# EasyEDA Pro project CH32V203_Wireless_Charge_V2.0.eprj

# Schematic CH32V203_Wireless_Charge
Create Date: 2023-07-03; Page Name: P1; Project Name: CH32V203_Wireless_Charge_V2.0; Schematic Name: CH32V203_Wireless_Charge; Update Date: 2023-07-03; Company: 嘉立创EDA; Page Size: A4; Version: V1.0
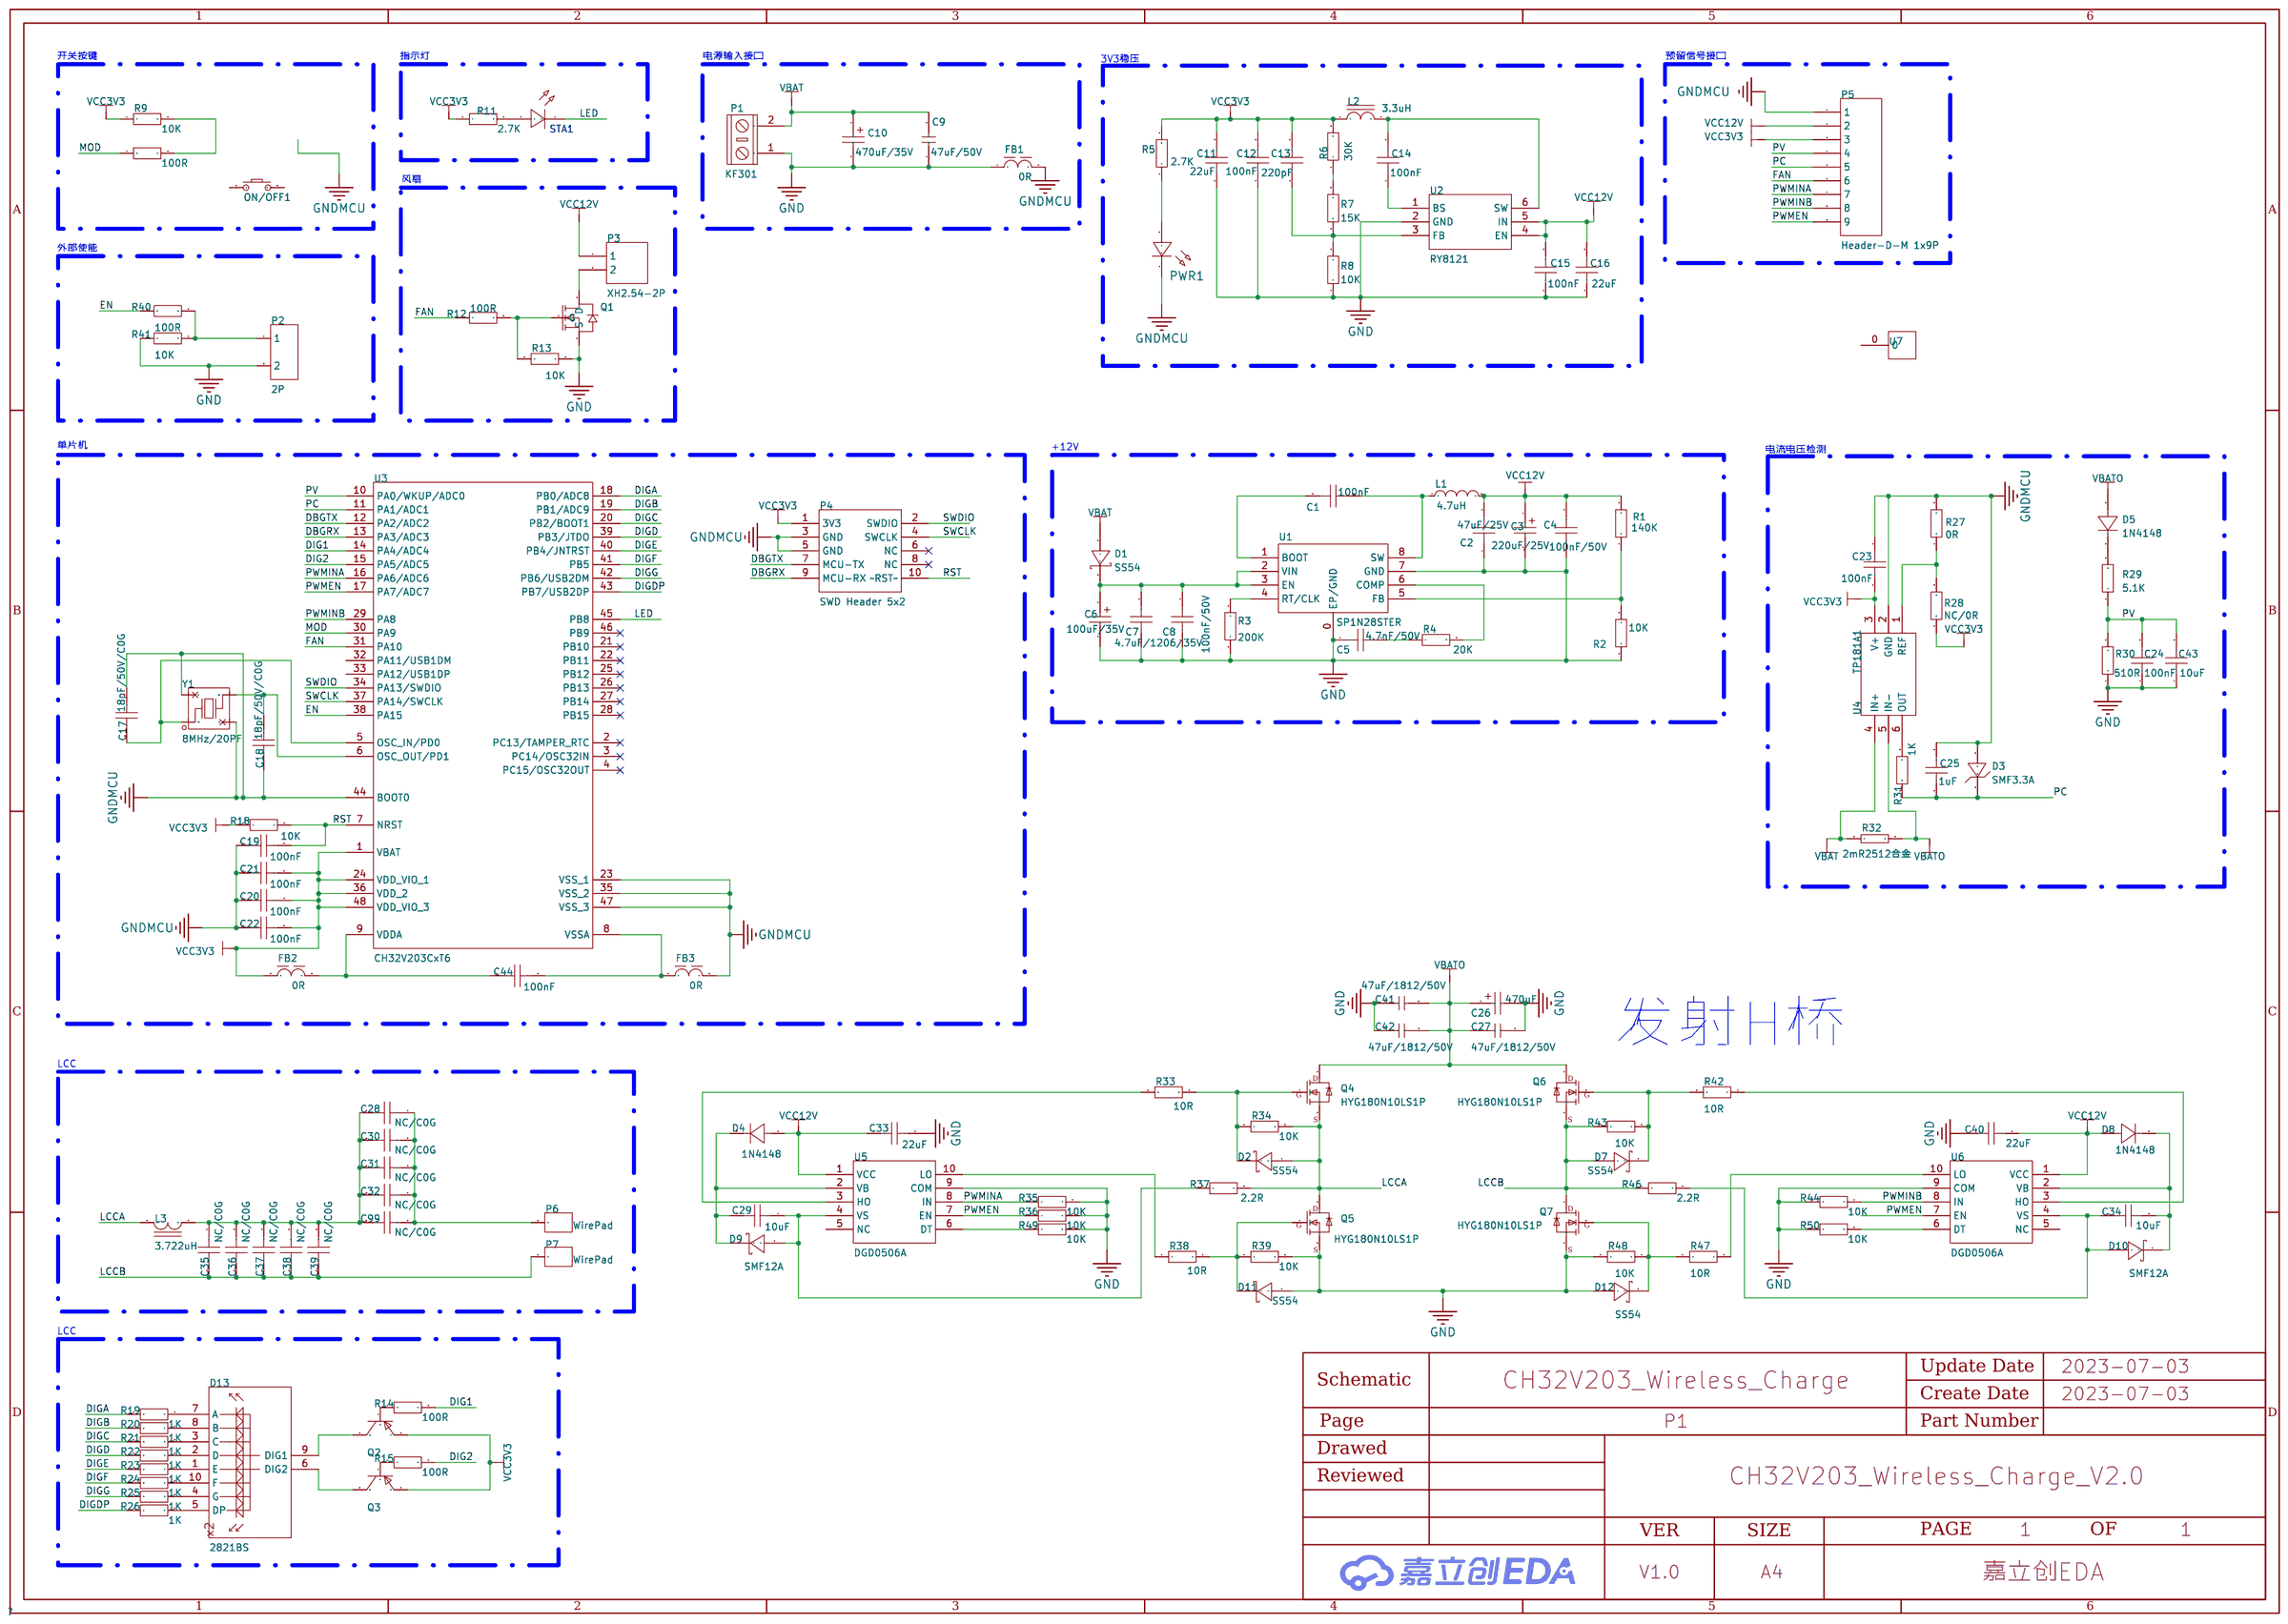
[diagram p0: schematic sheet]

## Parts
C1  100nF  [C0603]
C2  47uF/25V  [C1206]
C3  220uF  [Cap-S-D 2.5-6.3X8]
C4  100nF/50V  [C0603]
C5  4.7nF/50V  [C0603]
C6  100uF  [Cap-S-D 2.5-6.3X8]
C7  4.7uF/1206/35V  [C1206]
C8  100nF/50V  [C0603]
C9  47uF  [CAPC4532[1812]S]
C10  470uF  [Cap-S-D 3.5-8x14]
C11  22uF  [C0805]
C12  100nF  [C0603]
C13  220pF  [C0603]
C14  100nF  [C0603]
C15  100nF  [C0603]
C16  22uF  [C0805]
C17  18pF/50V/C0G  [C0603]
C18  18pF/50V/C0G  [C0603]
C19  100nF  [C0603]
C20  100nF  [C0603]
C21  100nF  [C0603]
C22  100nF  [C0603]
C23  100nF  [C0603]
C24  100nF  [C0603]
C25  1uF  [C0603]
C26  470uF  [Cap-S-D 3.5-8x14]
C27  47uF  [CAPC4532[1812]S]
C28  NC/C0G  [C1206]
C29  10uF  [C0805]
C30  NC/C0G  [C1206]
C31  NC/C0G  [C1206]
C32  NC/C0G  [C1206]
C33  22uF  [C0805]
C34  10uF  [C0805]
C35  NC/C0G  [C1206]
C36  NC/C0G  [C1206]
C37  NC/C0G  [C1206]
C38  NC/C0G  [C1206]
C39  NC/C0G  [C1206]
C40  22uF  [C0805]
C41  47uF  [CAPC4532[1812]S]
C42  47uF  [CAPC4532[1812]S]
C43  10uF  [C0805]
C44  100nF  [C0603]
C99  NC/C0G  [C1206]
D1  SS54  [SMA_L4.4-W2.8-LS5.4-R-RD]
D2  SS54  [SMA_L4.4-W2.8-LS5.4-R-RD]
D3  SMF3.3A  [SOD-123_L2.8-W1.8-LS3.7-RD]
D4  1N4148  [SOD-123_L2.7-W1.6-LS3.7-RD]
D5  1N4148  [SOD-123_L2.7-W1.6-LS3.7-RD]
D7  SS54  [SMA_L4.4-W2.8-LS5.4-R-RD]
D8  1N4148  [SOD-123_L2.7-W1.6-LS3.7-RD]
D9  SMF12A  [SOD-123F_L2.8-W1.8-LS3.7-RD]
D10  SMF12A  [SOD-123F_L2.8-W1.8-LS3.7-RD]
D11  SS54  [SMA_L4.4-W2.8-LS5.4-R-RD]
D12  SS54  [SMA_L4.4-W2.8-LS5.4-R-RD]
D13  2821BS  [2821AS/BS]
FB1  0R  [INDC1608[0603]S]
FB2  0R  [INDC1608[0603]S]
FB3  0R  [INDC1608[0603]S]
L1  4.7uH  [IND-SMD_L7.3-W6.6]
L2  3.3uH  [0402 TPC 4*4*2]
L3  3.722uH  [T94/106-LAY]
ON/OFF1  Button  [KEY-2-DIP-6*6-S]
P1  KF301  [KF/WJ/DG 301-2p-5.0mm]
P2  2P  [HDR-TH_2P-P2.54-V-M-1]
P3  XH2.54-2P  [XH2.54-2P-DV]
P4  SWD  [HDR2X5-M]
P5  Header-D-M1x9P  [HDR1X9-M]
P6  WirePad  [WirePad-4x6]
P7  WirePad  [WirePad-4x6]
PWR1  -  [LED_0603]
Q1  -  [SOT-23-3_L2.9-W1.3-P1.90-LS2.4-BR]
Q2  -  [S8550P_SOT]
Q3  -  [S8550P_SOT]
Q4  HYG180N10LS1P  [TO-220-LAY]
Q5  HYG180N10LS1P  [TO-220-LAY]
Q6  HYG180N10LS1P  [TO-220-LAY]
Q7  HYG180N10LS1P  [TO-220-LAY]
R1  140K  [R0603]
R2  10K  [R0603]
R3  200K  [R0603]
R4  20K  [R0603]
R5  2.7K  [R0603]
R6  30K  [R0603]
R7  15K  [R0603]
R8  10K  [R0603]
R9  10K  [R0603]
R10  100R  [R0603]
R11  2.7K  [R0603]
R12  100R  [R0603]
R13  10K  [R0603]
R14  100R  [R0603]
R15  100R  [R0603]
R18  10K  [R0603]
R19  1K  [R0603]
R20  1K  [R0603]
R21  1K  [R0603]
R22  1K  [R0603]
R23  1K  [R0603]
R24  1K  [R0603]
R25  1K  [R0603]
R26  1K  [R0603]
R27  0R  [R0603]
R28  NC/0R  [R0603]
R29  5.1K  [R0603]
R30  510R  [R0603]
R31  1K  [R0603]
R32  2mR  [RESC6332[2512]S]
R33  10R  [R0603]
R34  10K  [R0603]
R35  10K  [R0603]
R36  10K  [R0603]
R37  2.2R  [R0603]
R38  10R  [R0603]
R39  10K  [R0603]
R40  100R  [R0603]
R41  10K  [R0603]
R42  10R  [R0603]
R43  10K  [R0603]
R44  10K  [R0603]
R46  2.2R  [R0603]
R47  10R  [R0603]
R48  10K  [R0603]
R49  10K  [R0603]
R50  10K  [R0603]
STA1  -  [LED_0603]
U1  SP1N28STER  [SP1N28STER]
U2  RY8121  [SOT-23-6]
U3  CH32V203CxT6  [LQFP48_L]
U4  TP181A1  [SOT-363]
U5  DGD0506A  [MSOP-10]
U6  DGD0506A  [MSOP-10]
U7  -  [Cooler-5.5]
Y1  8MHz/20PF  [X3225-4]

## Library data of the parts
C1 C4 C5 C8 C12-C15 C17-C25 C44 = CAP_0603: Supplier Footprint: 0603
C2 C7 C28 C30-C32 C35-C39 C99 = CAP_1206: Supplier Footprint: 1206
C3 = S-D 220uF 25V 6.3x8: Revision: V1.0; Type: 聚合物固态; Voltage: 25V
C6 = S-D 100uF 35V 6.3x8: Revision: V1.0; Type: 聚合物固态; Voltage: 35V
C9 C27 C41 C42 = 47uF 1812 50V X5R: Revision: V1.0; Voltage: 50V; Type: X5R; Origin Footprint 2: CAPC4532[1812]
C10 C26 = S-D 470uF 35V 8x14: Revision: V1.0; Type: 聚合物固态; Voltage: 35V
C11 C16 C29 C33 C34 C40 C43 = CAP_0805: Supplier Footprint: 0805
D1 D2 D7 D11 D12 = SS54_C22452: 直流反向耐压(Vr):40V;平均整流电流(Io):5A;正向压降(Vf):550mV@5A;; LCSC Part Name: 40V5A550mV@5A; Supplier Part: C22452; Manufacturer: MDD; Supplier Footprint: SMA(DO-214AC); JLCPCB Part Class: 基础库; Datasheet: https://atta.szlcsc.com/upload/public/pdf/source/20190306/C22452_DC5E4F74C3B638F6D8E4C7650D5BF30E.pdf; Supplier: LCSC; Reverse Voltage (Vr): 40V; Average Rectified Current (Io): 5A; Forward Voltage (Vf@If): 550mV@5A
D3 = SMF3.3A_C283866: 极性:单向;反向截止电压(Vrwm):3.3V;击穿电压:5.2V;反向漏电流(Ir):600uA;峰值脉冲电流(Ipp)@10/1000μs:25A;最大钳位电压:8V;; LCSC Part Name: 单向Vrwm:3.3V; Supplier Part: C283866; Manufacturer: DOWO(东沃); Supplier Footprint: SOD-123; JLCPCB Part Class: ExtendedPart; Datasheet: https://atta.szlcsc.com/upload/public/pdf/source/20180913/C283866_6B3FC7DB82D40F63EC323F6A8CE1774A.pdf; Supplier: LCSC; Polarity: 单向; Reverse Stand-Off Voltage (Vrwm): 3.3V; Breakdown Voltage: 5.2V; Reverse Leakage Current (Ir): 600uA; Peak Pulse Current (Ipp)@10/1000μs: 25A; Maximum Clamping Voltage: 8V
D4 D5 D8 = 1N4148W_C908248: 二极管配置:独立式;功率:400mW;直流反向耐压(Vr):75V;平均整流电流(Io):150mA;正向压降(Vf):1.25V@150mA;反向电流(Ir):2.5μA@75V;反向恢复时间(trr):8ns;工作温度:-55℃~+150℃@(Tj);; LCSC Part Name: 75V150mA8ns; Supplier Part: C908248; Manufacturer: FUXINSEMI(富芯森美); Supplier Footprint: SOD-123; JLCPCB Part Class: ExtendedPart; Datasheet: https://atta.szlcsc.com/upload/public/pdf/source/20201027/C908248_1CA42330540990D53F511325C125C4BD.pdf; Supplier: LCSC; Diode Configuration: 独立式; Power Dissipation: 400mW; Reverse Voltage (Vr): 75V; Average Rectified Current (Io): 150mA; Forward Voltage (Vf@If): 1.25V@150mA; Reverse Leakage Current: 2.5μA@75V; Reverse Recovery Time (trr): 8ns; Operating Temperature: -55℃~+150℃@(Tj)
D9 D10 = SMF12A_C207255: 极性:单向;反向截止电压(Vrwm):12V;击穿电压:13.3V;峰值脉冲电流(Ipp)@10/1000μs:-;最大钳位电压:19.9V;峰值脉冲功率(Ppp)@10/1000μs:200W;; LCSC Part Name: 单向Vrwm:12V200W; Supplier Part: C207255; Manufacturer: Littelfuse(美国力特); Supplier Footprint: SOD-123F; JLCPCB Part Class: ExtendedPart; Datasheet: https://atta.szlcsc.com/upload/public/pdf/source/20180517/C207255_4FB9557FD9A9DAB230014B48638D9A3D.pdf; Supplier: LCSC; Polarity: 单向; Reverse Stand-Off Voltage (Vrwm): 12V; Breakdown Voltage: 13.3V; Maximum Clamping Voltage: 19.9V; Peak Pulse Power Dissipation (Ppp)@10/1000μs: 200W
D13 = 2821BS
FB1-FB3 = FB-Chip: Published: 2020-12-18; Revision: V1.0; DCR: .1m; Frequency: @100MHz; Imax: 500mA; Origin Footprint 2: INDC2012[0805]S; Origin Footprint 3: INDC3216[1206]S; Origin Footprint 4: INDC4509[1806]S; Origin Footprint 5: INDC1005[0402]; Origin Footprint 6: INDC1608[0603]; Origin Footprint 7: INDC2012[0805]; Origin Footprint 8: INDC3216[1206]; Origin Footprint 9: INDC3225[1210]; Origin Footprint 10: INDC3216[1206]; Origin Footprint 11: INDC1005[0402]S
L1 = MCS0630-4R7MPY1: 电感值:4.7uH;精度:±20%;额定电流:5.5A;饱和电流(Isat):7A;直流电阻(DCR):37mΩ;; LCSC Part Name: 4.7uH±20%5.5A37mΩ; Supplier Part: C2937097; Manufacturer: PSA(信昌电陶); Supplier Footprint: 0630; JLCPCB Part Class: 扩展库; Datasheet: https://atta.szlcsc.com/upload/public/pdf/source/20220121/EA6E6E6F70ED7BAE67EC293805EAAACB.pdf; Supplier: LCSC; Tolerance: ±20%; Rated Current: 5.5A; Saturation Current (Isat): 7A; DC Resistance (DCR): 37mΩ
L2 = Ind-Power_1: Published: 8-Jun-2000; Revision: July-2002:Re-releasedforDXPPlatform.; Publisher: AltiumLimited; DCR: .5m; Price(RMB): 0.000; Imax: 2.5A; Origin Footprint 2: CD31; Origin Footprint 3: CD32; Origin Footprint 4: CD42; Origin Footprint 5: CD43; Origin Footprint 6: CD52; Origin Footprint 7: CD53; Origin Footprint 8: CD54; Origin Footprint 9: CD73; Origin Footprint 10: CD75; Origin Footprint 11: CD104; Origin Footprint 12: CD105; Origin Footprint 13: CD106; Origin Footprint 14: 127Shielded12.5*12.5*7; Origin Footprint 15: 0630TPC7*7*3; Origin Footprint 16: 1050TPC10*10*5; Origin Footprint 17: 1265TPC12*12*6.5; Origin Footprint 18: CD104R; Origin Footprint 19: SLO2520; Origin Footprint 20: 1365TPC13*13*6.5; Origin Footprint 21: INDUCTOR; Origin Footprint 22: INDUCTOR-H
L3 = Ind-Power_2: Published: 8-Jun-2000; Revision: July-2002:Re-releasedforDXPPlatform.; Publisher: AltiumLimited; Imax: 50mA; DCR: .5m; Price(RMB): 0.000; Origin Footprint 2: CD31; Origin Footprint 3: CD32; Origin Footprint 4: CD42; Origin Footprint 5: CD43; Origin Footprint 6: CD52; Origin Footprint 7: CD53; Origin Footprint 8: CD54; Origin Footprint 9: CD73; Origin Footprint 10: CD75; Origin Footprint 11: CD104; Origin Footprint 12: CD105; Origin Footprint 13: CD106; Origin Footprint 14: 127Shielded12.5*12.5*7; Origin Footprint 15: 0630TPC7*7*3; Origin Footprint 16: 1050TPC10*10*5; Origin Footprint 17: 1265TPC12*12*6.5; Origin Footprint 18: CD104R; Origin Footprint 19: SLO2520; Origin Footprint 20: 1365TPC13*13*6.5; Origin Footprint 21: T80125
ON/OFF1 = KEY: Published: 24-Mar-1999; Publisher: Altium Limited; Price(RMB): 0.000; Origin Footprint 2: KEY-2-SMD-3*4; Origin Footprint 3: KEY-4-DIP-6*6; Origin Footprint 4: PTS810-3*4-CurvePin; Origin Footprint 5: KEY-2-SMD-3*6-L; Origin Footprint 6: KEY-2-SMD-3*6-M; Origin Footprint 7: KEY-4-SMD-6*6; Origin Footprint 8: KEY-2-SMD-Side-3*6*3.5; Origin Footprint 9: KEY-4-SMD-12*12; Origin Footprint 10: TS-1809SM-A; Origin Footprint 11: TS-1199A
P1 = KF/WJ/DG 30x
P2 = 826629-2: 排数:单排;总PIN位数:2;间距:2.54mm;插针结构:1x2P;行距:-;安装类型:直插;圆针/方针:-;额定电流:-;额定电压:-;配合针长度:-;塑高:2.8mm;触头材质:黄铜;触头镀层:-;颜色:绿色;; LCSC Part Name: 2.54mm1x2P直插; Supplier Part: C86471; Manufacturer: TEConnectivity(美国泰科); Supplier Footprint: 插件,P=2.54mm; JLCPCB Part Class: ExtendedPart; Datasheet: https://atta.szlcsc.com/upload/public/pdf/source/20161105/1478330325829.pdf; Supplier: LCSC; Number of Rows: 单排; Number of Pins: 2; Pitch: 2.54mm; Pin Structure: 1x2P; Mounting Type: 直插; Insulation Height: 2.8mm; Contact Material: 黄铜; Color: 绿色
P3 = XH2.54-2P: Revision: V1.0; Origin Footprint 2: XH2.54-2P-DH; Origin Footprint 3: XH2.54-2P-SH
P4 = SWD Header 5x2: Revision: V1.0; Origin Footprint 2: HDR2X5-M-SMT
P5 = Header-D-M 1x9P: Revision: V1.0
P6 P7 = WirePad: Origin Footprint 2: WirePad-4.5x7
PWR1 = LED_0603-R: Supplier Footprint: 0603
Q1 = AO3400A_N: 类型:N沟道;漏源电压(Vdss):30V;连续漏极电流(Id):5.2A;功率(Pd):1W;导通电阻(RDS(on)@Vgs,Id):35mΩ@10V,5A;阈值电压(Vgs(th)@Id):1.5V@250μA;; Supplier Footprint: SOT-23; Supplier Part: C700953
Q2 Q3 = S8550_SOT_PNP: Supplier Footprint: SOT-23
Q4-Q7 = HYG180N10LS1P: Origin Footprint 2: TO-220
R1-R15 R18-R31 R33-R44 R46-R50 = Res_0603: Supplier Footprint: 0603
R32 = Res-Chip_10: Revision: V1.0; Power: 1/8W; Tolerance: ±1%; Origin Footprint 2: RESC0603[0201]-L; Origin Footprint 3: RESC0603[0201]-M; Origin Footprint 4: RESC0603[0201]-N; Origin Footprint 5: RESC0603[0201]S-L; Origin Footprint 6: RESC0603[0201]S-M; Origin Footprint 7: RESC0603[0201]S-N; Origin Footprint 8: RESC1005[0402]-L; Origin Footprint 9: RESC1005[0402]S-M; Origin Footprint 10: RESC1005[0402]-M; Origin Footprint 11: RESC1005[0402]-N; Origin Footprint 12: RESC1005[0402]S-L; Origin Footprint 13: RESC1005[0402]S-N; Origin Footprint 14: RESC1608[0603]-L; Origin Footprint 15: RESC1608[0603]-M; Origin Footprint 16: RESC1608[0603]-N; Origin Footprint 17: RESC1608[0603]S-L; Origin Footprint 18: RESC1608[0603]S-M; Origin Footprint 19: RESC1608[0603]S-N; Origin Footprint 20: RESC2012[0805]; Origin Footprint 21: RESC2012[0805]S-L; Origin Footprint 22: RESC2012[0805]S-M; Origin Footprint 23: RESC2012[0805]S-N; Origin Footprint 24: RESC3216[1206]; Origin Footprint 25: RESC3216[1206]S-L; Origin Footprint 26: RESC3216[1206]S-M; Origin Footprint 27: RESC3216[1206]S-N; Origin Footprint 28: RESC3225[1210]; Origin Footprint 29: RESC3225[1210]S; Origin Footprint 30: RESC5025[2010]; Origin Footprint 31: RESC5025[2010]S; Origin Footprint 32: RESC6332[2512]
STA1 = LED_0603-B: Supplier Footprint: 0603
U1 = SP1N28STER: Revision: V1.0
U2 = RY8121
U3 = CH32V203CxT6: Published: 30-May-2008; DatasheetVersion: rev6,Mar-2008; PackageVersion: Mar-2008; PackageReference: LQFP48; Publisher: AltiumLimited; PackageDescription: 48-PinLow-ProfileQuadFlatPack,7x7mmBody,0.5mmPitch(LQFP48); ComponentLink1Description: ManufacturerLink; ComponentLink1URL: www.st.com/stm32; ComponentLink2Description: Datasheet; ComponentLink2URL: http://www.st.com/stonline/products/literature/ds/13587.pdf; Origin Footprint 2: LQFP48_N; Origin Footprint 3: LQFP48_M
U4 = TP181Ax
U5 U6 = DGD0506A
U7 = fan
Y1 = XTAL-4: Published: 8-Jun-2000; Revision: July-2002:Re-releasedforDXPPlatform.; Publisher: AltiumLimited; Load Capactiance: 20pF; Frequency: 8MHz; Origin Footprint 2: X2016-4

## Nets
GND: C2.1 C3.2 C4.1 C5.1 C6.2 C7.1 C8.1 C9.1 C10.2 C11.1 C12.1 C15.1 C16.1 C24.1 C26.2 C27.2 C33.1 C40.1 C41.1 C42.1 C43.1 D11.1(A) D12.1(A) FB1.1 P1.1 P2.2 Q1.2(S) Q5.3(S) Q7.3(S) R2.1 R3.1 R8.1 R13.2 R30.1 R35.2 R36.2 R39.2 R41.1 R44.2 R48.2 R49.2 R50.2 U1.0(EP/GND) U1.7(GND) U2.2(GND) U5.9(COM) U6.9(COM)
GNDMCU: C17.2 C18.1 C19.1 C20.1 C21.1 C22.1 C23.2 C25.2 D3.2 FB1.2 FB3.2 P4.3(GND) P4.5(GND) P5.1 PWR1.1(C) R27.2 U3.23(VSS_1) U3.35(VSS_2) U3.44(BOOT0) U3.47(VSS_3) U4.2(GND) Y1.2(NC) Y1.4(NC)
VBAT: C9.2 C10.1 D1.1(A) P1.2 R32.1 U4.4(IN+)
VBATO: C26.1 C27.1 C41.2 C42.2 D5.2(A) Q4.2(D) Q6.2(D) R32.2 U4.5(IN-)
VCC3V3: C11.2 C12.2 C13.2 C20.2 C21.2 C22.2 C23.1 FB2.1 L2.1 P4.1(3V3) P5.3 Q2.2(E) Q3.2(E) R5.2 R6.2 R9.1 R11.1 R18.1 R28.1 U3.1(VBAT) U3.24(VDD_VIO_1) U3.36(VDD_2) U3.48(VDD_VIO_3) U4.3(V+)
VCC12V: C2.2 C3.1 C4.2 C15.2 C16.2 C33.2 C40.2 D4.2(A) D8.2(A) L1.2 P3.1 P5.2 R1.2 U2.4(EN) U2.5(IN) U5.1(VCC) U6.1(VCC)
DBGRX: P4.9(MCU-RX) U3.13(PA3/ADC3)
DBGTX: P4.7(MCU-TX) U3.12(PA2/ADC2)
DIG1: R14.2 U3.14(PA4/ADC4)
DIG2: R15.2 U3.15(PA5/ADC5)
DIGA: R19.1 U3.18(PB0/ADC8)
DIGB: R20.1 U3.19(PB1/ADC9)
DIGC: R21.1 U3.20(PB2/BOOT1)
DIGD: R22.1 U3.39(PB3/JTDO)
DIGDP: R26.1 U3.43(PB7/USB2DP)
DIGE: R23.1 U3.40(PB4/JNTRST)
DIGF: R24.1 U3.41(PB5)
DIGG: R25.1 U3.42(PB6/USB2DM)
EN: R40.1 U3.38(PA15)
FAN: P5.6 R12.1 U3.31(PA10)
LCCA: D2.1(A) L3.2 Q4.3(S) Q5.2(D) R34.2 R37.2
LCCB: C35.1 C36.1 C37.1 C38.1 C39.1 D7.1(A) P7.1 Q6.3(S) Q7.2(D) R43.2 R46.2
LED: STA1.1(C) U3.45(PB8)
MOD: R10.1 U3.30(PA9)
PC: C25.1 D3.1 P5.5 R31.1 U3.11(PA1/ADC1)
PV: C24.2 C43.2 P5.4 R29.1 R30.2 U3.10(PA0/WKUP/ADC0)
PWMEN: P5.9 R36.1 U3.17(PA7/ADC7) U5.7(EN) U6.7(EN)
PWMINA: P5.7 R35.1 U3.16(PA6/ADC6) U5.8(IN)
PWMINB: P5.8 R44.1 U3.29(PA8) U6.8(IN)
RST: C19.2 P4.10(~RST~) R18.2 U3.7(NRST)
SWCLK: P4.4(SWCLK) U3.37(PA14/SWCLK)
SWDIO: P4.2(SWDIO) U3.34(PA13/SWDIO)
$1N403: P2.1 R40.2 R41.2
$1N541: R11.2 STA1.2(A)
$1N1505: R3.2 U1.4(RT/CLK)
$1N1506: C6.1 C7.2 C8.2 D1.2(K) U1.2(VIN) U1.3(EN)
$1N1507: C1.1 U1.1(BOOT)
$1N1508: C5.2 R4.1
$1N1509: R4.2 U1.6(COMP)
$1N1513: C1.2 L1.1 U1.8(SW)
$1N1550: R1.1 R2.2 U1.5(FB)
$1N1853: Q1.1(G) R12.2 R13.1
$1N1871: P3.2 Q1.3(D)
$1N2473: C17.1 U3.5(OSC_IN/PD0) Y1.1(OSC1)
$1N2508: C18.2 U3.6(OSC_OUT/PD1) Y1.3(OSC2)
$1N2983: C44.1 FB2.2 U3.9(VDDA)
$1N3027: C44.2 FB3.1 U3.8(VSSA)
$1N4290: R6.1 R7.2
$1N4601: PWR1.2(A) R5.1
$1N4657: C13.1 R7.1 R8.2 U2.3(FB)
$1N4721: C14.1 U2.1(BS)
$1N4725: C14.2 L2.2 U2.6(SW)
$1N5172: R27.1 R28.2 U4.1(REF)
$1N5239: R31.2 U4.6(OUT)
$1N5693: D5.1(K) R29.2
$1N6757: C28.2 C30.2 C31.2 C32.2 C35.2 C36.2 C37.2 C38.2 C39.2 C99.2 L3.1
$1N6824: C28.1 C30.1 C31.1 C32.1 C99.1 P6.1
$1N7211: C29.2 D4.1(K) D9.1(K) U5.2(VB)
$1N7329: R49.1 U5.6(DT)
$1N7526: D2.2(K) Q4.1(G) R33.2 R34.1
$1N7580: R33.1 U5.3(HO)
$1N7689: C29.1 D9.2(A) R37.1 U5.4(VS)
$1N7780: R38.1 U5.10(LO)
$1N7784: D11.2(K) Q5.1(G) R38.2 R39.1
$1N8257: C34.2 D8.1(K) D10.1(K) U6.2(VB)
$1N8271: R50.1 U6.6(DT)
$1N8282: D7.2(K) Q6.1(G) R42.2 R43.1
$1N8287: R42.1 U6.3(HO)
$1N8296: C34.1 D10.2(A) R46.1 U6.4(VS)
$1N8315: R47.1 U6.10(LO)
$1N8318: D12.2(K) Q7.1(G) R47.2 R48.1
$1N8930: D13.7(A) R19.2
$1N8955: D13.8(B) R20.2
$1N8979: D13.3(C) R21.2
$1N9003: D13.2(D) R22.2
$1N9027: D13.1(E) R23.2
$1N9051: D13.10(F) R24.2
$1N9075: D13.4(G) R25.2
$1N9099: D13.5(DP) R26.2
$1N9205: D13.9(DIG1) Q2.3(C)
$1N9209: D13.6(DIG2) Q3.3(C)
$1N9253: Q3.1(B) R15.1
$1N9278: Q2.1(B) R14.1
Net-(R9-2): R9.2 R10.2

Not connected (* = marked no-connect by the designer): ON/OFF1 1 2; P4 6(NC)* 8(NC)*; U3 2(PC13/TAMPER_RTC)* 3(PC14/OSC32IN)* 4(PC15/OSC32OUT)* 21(PB10)* 22(PB11)* 25(PB12)* 26(PB13)* 27(PB14)* 28(PB15)* 32(PA11/USB1DM) 33(PA12/USB1DP) 46(PB9)*; U5 5(NC); U6 5(NC); U7 0

## Notes on the sheet
- 开关按键
- 指示灯
- 电源输入接口
- 3V3稳压
- 预留信号接口
- 风扇
- 外部使能
- 单片机
- +12V
- 电流电压检测
- 发射H桥
- LCC
- LCC

# Board CH32V203_Wireless_Charge
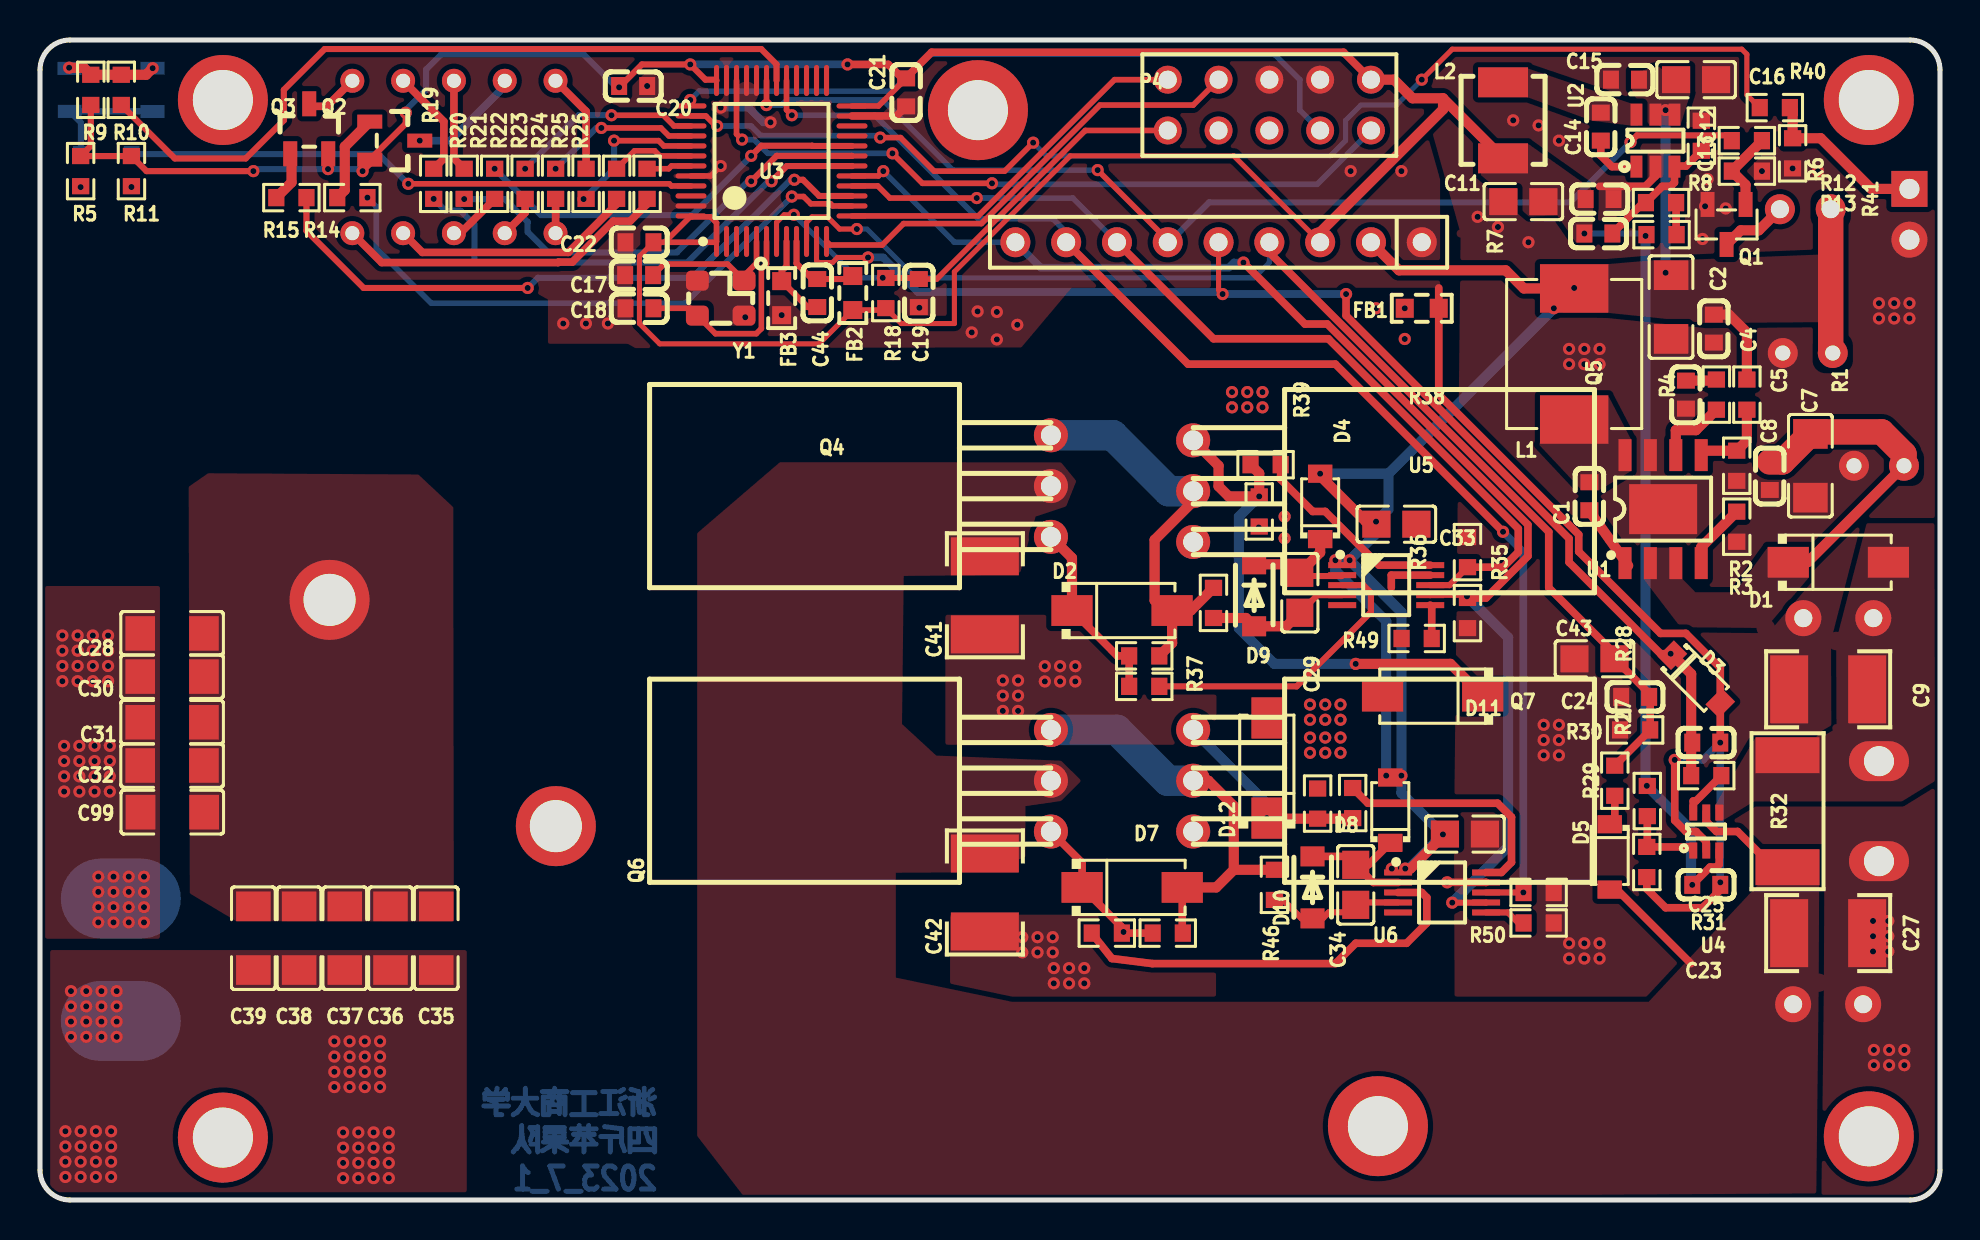
[diagram p1: board, top side]
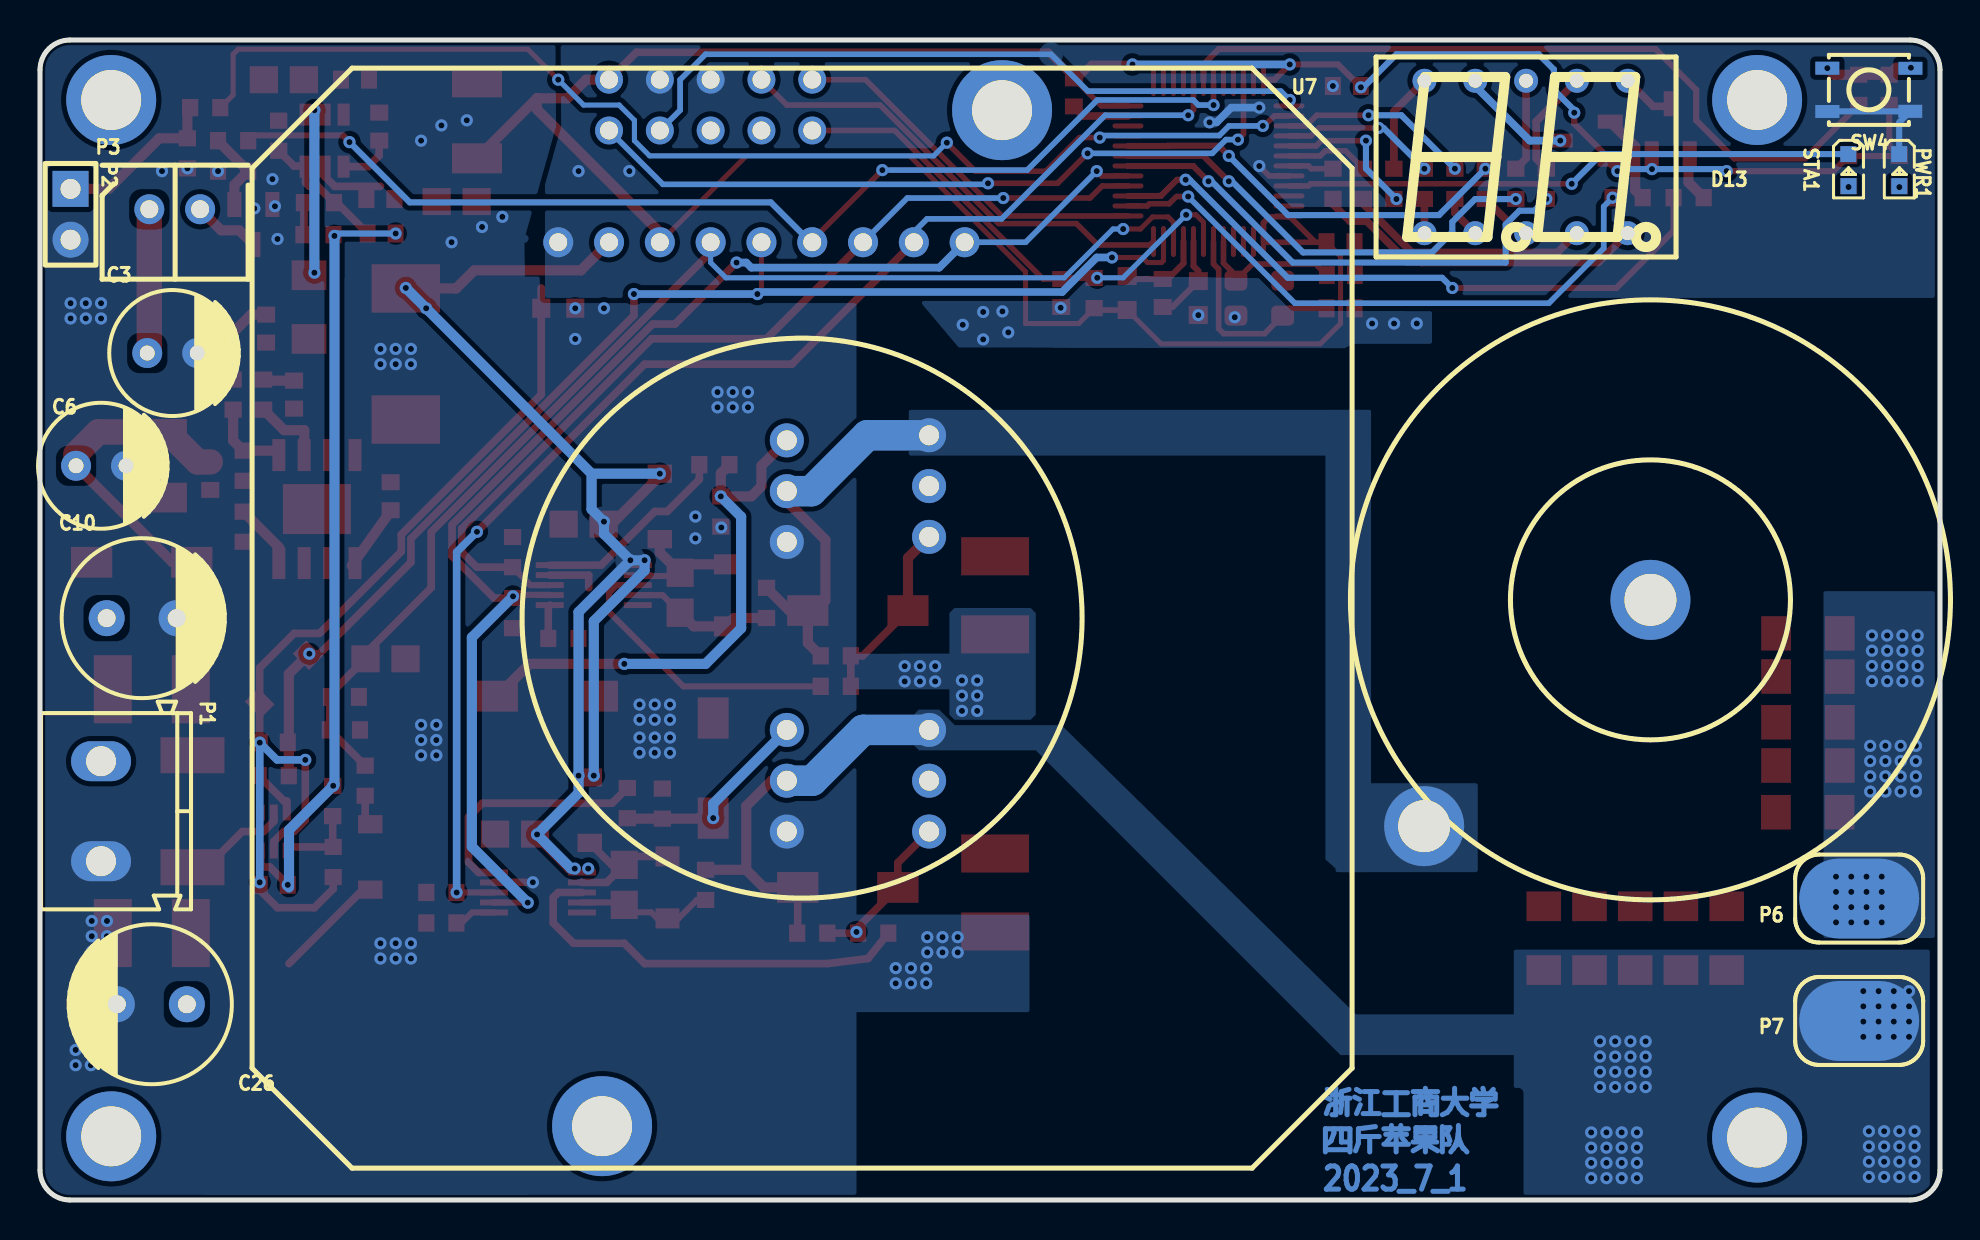
[diagram p2: board, bottom side, seen from below]

Outline 95 x 58 mm; copper layers: Top Layer, Bottom Layer. Coordinates in mm from the lower left corner of the outline.
Outline path: 0,56.5 0,1.5 arc(0.44,0.44) 1.5,0 93.5,0 arc(94.56,0.44) 95,1.5 95,56.5 arc(94.56,57.56) 93.5,58 1.5,58 arc(0.44,57.56) 0,56.5
Stack: Top Layer 0.035mm / Dielectric1 1.51mm FR4 er 4.5 / Bottom Layer 0.035mm

## Design rules (mm)
template: 自定义配置
spacing copperThickness1oz (default): track to track 0.102, other pairs 0.152 to 0.3
spacing copperThickness2oz: track to track 0.203, other pairs 0.152 to 0.3
track width copperThickness1oz (default): min 0.127, default 0.254, max 2.54
track width copperThickness2oz: min 0.203, default 0.254, max 2.54
differential pair differentialPair (default): width min 0.127, default 0.254, max 2.54; gap min 0.152, default 0.152
via viaSize (default): diameter min 0.5, default 0.61, max 10; hole min 0.3, default 0.305, max 6.299

## Placement (name value [footprint] x y rotation side)
C1  100nF  [C0603]  77.47 35.19 90 top
C2  47uF/25V  [C1206]  81.55 44.65 90 top
C3  220uF  [Cap-S-D 2.5-6.3X8]  88.39 42.35 180 bottom
C4  100nF/50V  [C0603]  83.69 43.57 90 top
C5  4.7nF/50V  [C0603]  82.3 40.27 90 top
C6  100uF  [Cap-S-D 2.5-6.3X8]  91.95 36.71 180 bottom
C7  4.7uF/1206/35V  [C1206]  88.52 36.71 90 top
C8  100nF/50V  [C0603]  86.49 36.2 90 top
C9  47uF  [CAPC4532[1812]S]  89.41 25.54 0 top
C10  470uF  [Cap-S-D 3.5-8x14]  89.92 29.09 180 bottom
C11  22uF  [C0805]  74.17 49.92 0 top
C12  100nF  [C0603]  77.98 50.05 180 top
C13  220pF  [C0603]  77.92 48.32 180 top
C14  100nF  [C0603]  78.04 53.67 90 top
C15  100nF  [C0603]  79.25 56.02 0 top
C16  22uF  [C0805]  82.8 56.02 180 top
C17  18pF/50V/C0G  [C0603]  29.96 46.24 180 top
C18  18pF/50V/C0G  [C0603]  29.97 44.59 0 top
C19  100nF  [C0603]  43.94 45.35 90 top
C20  100nF  [C0603]  29.66 55.7 180 top
C21  100nF  [C0603]  43.31 55.38 90 top
C22  100nF  [C0603]  29.97 47.89 0 top
C23  100nF  [C0603]  83.31 15.76 0 top
C24  100nF  [C0603]  79.76 25.16 0 top
C25  1uF  [C0603]  83.31 22.87 0 top
C26  470uF  [Cap-S-D 3.5-8x14]  89.41 9.79 0 bottom
C27  47uF  [CAPC4532[1812]S]  89.41 13.34 0 top
C28  NC/C0G  [C1206]  6.6 28.33 0 top
C29  10uF  [C0805]  62.99 30.36 90 top
C30  NC/C0G  [C1206]  6.6 26.17 0 top
C31  NC/C0G  [C1206]  6.6 23.89 0 top
C32  NC/C0G  [C1206]  6.6 21.73 0 top
C33  22uF  [C0805]  67.82 33.79 180 top
C34  10uF  [C0805]  65.79 15.76 90 top
C35  NC/C0G  [C1206]  19.81 13.09 90 top
C36  NC/C0G  [C1206]  17.53 13.09 90 top
C37  NC/C0G  [C1206]  15.24 13.09 90 top
C38  NC/C0G  [C1206]  12.95 13.09 90 top
C39  NC/C0G  [C1206]  10.67 13.09 90 top
C40  22uF  [C0805]  71.25 18.3 180 top
C41  47uF  [CAPC4532[1812]S]  47.24 30.23 90 top
C42  47uF  [CAPC4532[1812]S]  47.24 15.38 90 top
C43  10uF  [C0805]  77.72 27.06 0 top
C44  100nF  [C0603]  38.86 45.35 270 top
C99  NC/C0G  [C1206]  6.61 19.39 0 top
D1  SS54  [SMA_L4.4-W2.8-LS5.4-R-RD]  89.92 31.89 0 top
D2  SS54  [SMA_L4.4-W2.8-LS5.4-R-RD]  54.1 29.47 0 top
D3  SMF3.3A  [SOD-123_L2.8-W1.8-LS3.7-RD]  82.82 26.04 315 top
D4  1N4148  [SOD-123_L2.7-W1.6-LS3.7-RD]  64.01 34.68 90 top
D5  1N4148  [SOD-123_L2.7-W1.6-LS3.7-RD]  78.49 17.15 270 top
D7  SS54  [SMA_L4.4-W2.8-LS5.4-R-RD]  54.61 15.63 0 top
D8  1N4148  [SOD-123_L2.7-W1.6-LS3.7-RD]  67.51 19.49 90 top
D9  SMF12A  [SOD-123F_L2.8-W1.8-LS3.7-RD]  60.71 30.23 270 top
D10  SMF12A  [SOD-123F_L2.8-W1.8-LS3.7-RD]  63.63 15.63 270 top
D11  SS54  [SMA_L4.4-W2.8-LS5.4-R-RD]  69.63 25.19 180 top
D12  SS54  [SMA_L4.4-W2.8-LS5.4-R-RD]  61.34 21.6 90 top
D13  2821BS  [2821AS/BS]  20.7 52.15 180 bottom
FB1  0R  [INDC1608[0603]S]  69.09 44.59 0 top
FB2  0R  [INDC1608[0603]S]  40.64 45.35 90 top
FB3  0R  [INDC1608[0603]S]  37.08 45.09 270 top
L1  4.7uH  [IND-SMD_L7.3-W6.6]  76.71 42.3 270 top
L2  3.3uH  [0402 TPC 4*4*2]  73.15 53.98 90 top
L3  3.722uH  [T94/106-LAY]  14.48 30.01 315 bottom
NOREF  -  [Pad_e292]  91.44 3.18 0 top
NOREF#2  -  [Pad_e295]  91.44 55 0 top
NOREF#3  -  [Pad_e294]  9.14 55 0 top
NOREF#4  -  [Pad_e293]  9.14 3.12 0 top
P1  KF301  [KF/WJ/DG 301-2p-5.0mm]  91.95 19.44 270 bottom
P2  2P  [HDR-TH_2P-P2.54-V-M-1]  93.47 49.28 270 bottom
P3  XH2.54-2P  [XH2.54-2P-DV]  89.53 49.54 180 bottom
P4  SWD  [HDR2X5-M]  66.55 56.02 180 top
P5  Header-D-M1x9P  [HDR1X9-M]  69.09 47.89 180 top
P6  WirePad  [WirePad-4x6]  4.04 15.07 180 bottom
P7  WirePad  [WirePad-4x6]  4.04 8.95 180 bottom
PWR1  -  [LED_0603]  2.03 51.44 270 bottom
Q1  -  [SOT-23-3_L2.9-W1.3-P1.90-LS2.4-BR]  84.33 48.78 90 top
Q2  -  [S8550P_SOT]  17.78 52.97 180 top
Q3  -  [S8550P_SOT]  13.46 53.6 270 top
Q4  HYG180N10LS1P  [TO-220-LAY]  50.55 33.16 90 top
Q5  HYG180N10LS1P  [TO-220-LAY]  57.66 37.98 270 top
Q6  HYG180N10LS1P  [TO-220-LAY]  50.55 18.42 90 top
Q7  HYG180N10LS1P  [TO-220-LAY]  57.66 23.5 270 top
R1  140K  [R0603]  85.34 40.27 90 top
R2  10K  [R0603]  84.84 36.71 90 top
R3  200K  [R0603]  84.84 33.66 90 top
R4  20K  [R0603]  83.82 40.27 270 top
R5  2.7K  [R0603]  2.03 51.44 90 top
R6  30K  [R0603]  81.08 48.27 180 top
R7  15K  [R0603]  81.05 49.87 0 top
R8  10K  [R0603]  83.07 53.21 270 top
R9  10K  [R0603]  2.54 55.51 90 top
R10  100R  [R0603]  4.06 55.51 90 top
R11  2.7K  [R0603]  4.57 51.44 270 top
R12  100R  [R0603]  85.34 52.97 0 top
R13  10K  [R0603]  85.34 51.44 0 top
R14  100R  [R0603]  15.62 50.12 0 top
R15  100R  [R0603]  12.57 50.12 0 top
R18  10K  [R0603]  42.29 45.35 90 top
R19  1K  [R0603]  19.69 50.81 90 top
R20  1K  [R0603]  21.21 50.81 90 top
R21  1K  [R0603]  22.73 50.81 270 top
R22  1K  [R0603]  24.26 50.81 270 top
R23  1K  [R0603]  25.78 50.81 270 top
R24  1K  [R0603]  27.31 50.81 90 top
R25  1K  [R0603]  28.83 50.81 270 top
R26  1K  [R0603]  30.35 50.81 270 top
R27  0R  [R0603]  80.34 16.9 270 top
R28  NC/0R  [R0603]  80.37 19.95 270 top
R29  5.1K  [R0603]  78.74 20.96 270 top
R30  510R  [R0603]  79.76 23.5 0 top
R31  1K  [R0603]  83.31 21.22 0 top
R32  2mR  [RESC6332[2512]S]  87.38 19.44 270 top
R33  10R  [R0603]  55.21 25.68 180 top
R34  10K  [R0603]  55.21 27.21 0 top
R35  10K  [R0603]  71.37 32.39 90 top
R36  10K  [R0603]  71.37 29.35 270 top
R37  2.2R  [R0603]  58.67 29.85 90 top
R38  10R  [R0603]  61.28 36.77 180 top
R39  10K  [R0603]  60.96 34.43 270 top
R40  100R  [R0603]  86.74 54.62 0 top
R41  10K  [R0603]  87.63 52.33 90 top
R42  10R  [R0603]  53.34 13.34 0 top
R43  10K  [R0603]  56.39 13.34 0 top
R44  10K  [R0603]  74.93 15.38 0 top
R46  2.2R  [R0603]  61.72 15.76 90 top
R47  10R  [R0603]  65.63 19.85 270 top
R48  10K  [R0603]  63.88 19.82 90 top
R49  10K  [R0603]  68.83 28.08 180 top
R50  10K  [R0603]  74.93 13.85 0 top
STA1  -  [LED_0603]  4.57 51.44 270 bottom
SW4  -  [SW-SMD_4P_PTS810SJM250SMTRLFS]  3.56 55.51 180 bottom
U1  -  [SP1N28STER]  81.16 34.55 90 top
U2  RY8121  [SOT-23-6]  80.77 52.97 90 top
U3  CH32V203CxT6  [LQFP48_L]  36.58 51.95 90 top
U4  TP181A1  [SOT-363]  83.31 18.42 90 top
U5  DGD0506A  [MSOP-10]  67.31 30.74 0 top
U6  DGD0506A  [MSOP-10]  70.1 15.38 0 top
U7  -  [Cooler-5.5]  56.9 29.09 270 bottom
Y1  8MHz/20PF  [X3225-4]  34.04 45.09 180 top

## Footprints (pads in the part's own frame, mm; a bottom-side part is the same pattern mirrored in y, then rotated)
0402 TPC 4*4*2
  rect 1.5x2.5 smd: 1(-1.9,0) 2(1.9,0)
2821AS/BS
  round 1.2 hole 0.7: 1(-5.08,-3.81) 2(-2.54,-3.81) 3(0,-3.81) 4(2.54,-3.81) 5(5.08,-3.81) 6(5.08,3.81) 7(2.54,3.81) 8(0,3.81) 9(-2.54,3.81) 10(-5.08,3.81)
C0603
  rect 0.8x0.9 smd: 1(-0.7,0) 2(0.7,0)
C0805
  rect 1.41x1.35 smd: 1(-1,0) 2(1,0)
C1206
  rect 1.485x1.728 smd: 1(-1.593,0) 2(1.593,0)
Cap-S-D 2.5-6.3X8
  rrect 1.5x1.5 hole 0.75: 1(-1.25,0)
  round 1.5 hole 0.75: 2(1.25,0)
Cap-S-D 3.5-8x14
  rrect 1.8x1.8 hole 0.9: 1(-1.75,0)
  round 1.8 hole 0.9: 2(1.75,0)
CAPC4532[1812]S
  rect 1.9x3.4 smd: 1(-1.95,0) 2(1.95,0)
Cooler-5.5
  round 5 hole 3: 0(-25.4,10) 0(25.4,-10)
HDR1X9-M
  round 1.5 hole 0.9: 1(0,0) 2(2.54,0) 3(5.08,0) 4(7.62,0) 5(10.16,0) 6(12.7,0) 7(15.24,0) 8(17.78,0) 9(20.32,0)
HDR2X5-M
  round 1.397 hole 0.9: 1(0,0) 2(0,2.54) 3(2.54,0) 4(2.54,2.54) 5(5.08,0) 6(5.08,2.54) 7(7.62,0) 8(7.62,2.54) 9(10.16,0) 10(10.16,2.54)
HDR-TH_2P-P2.54-V-M-1
  rect 1.8x1.8 hole 1: 1(-1.27,0)
  round 1.8 hole 1: 2(1.27,0)
IND-SMD_L7.3-W6.6
  rect 2.424x3.42 smd: 1(3.278,0) 2(-3.278,0)
INDC1608[0603]S
  rect 0.9x0.95 smd: 1(-0.85,0) 2(0.85,0)
KF/WJ/DG 301-2p-5.0mm
  oval 2x3 hole 1.5: 1(2.5,0) 2(-2.5,0)
LED_0603
  rect 0.8x0.8 smd: 1(-0.851,-0.01) 2(0.75,-0.005)
LQFP48_L
  oval 1.55x0.254 smd: 1(-4.025,2.75) 2(-4.025,2.25) 3(-4.025,1.75) 4(-4.025,1.25) 5(-4.025,0.75) 6(-4.025,0.25) 7(-4.025,-0.25) 8(-4.025,-0.75) 9(-4.025,-1.25) 10(-4.025,-1.75) 11(-4.025,-2.25) 12(-4.025,-2.75) 25(4.025,-2.75) 26(4.025,-2.25) 27(4.025,-1.75) 28(4.025,-1.25) 29(4.025,-0.75) 30(4.025,-0.25) 31(4.025,0.25) 32(4.025,0.75) 33(4.025,1.25) 34(4.025,1.75) 35(4.025,2.25) 36(4.025,2.75)
  oval 0.254x1.55 smd: 13(-2.75,-4.025) 14(-2.25,-4.025) 15(-1.75,-4.025) 16(-1.25,-4.025) 17(-0.75,-4.025) 18(-0.25,-4.025) 19(0.25,-4.025) 20(0.75,-4.025) 21(1.25,-4.025) 22(1.75,-4.025) 23(2.25,-4.025) 24(2.75,-4.025) 37(2.75,4.025) 38(2.25,4.025) 39(1.75,4.025) 40(1.25,4.025) 41(0.75,4.025) 42(0.25,4.025) 43(-0.25,4.025) 44(-0.75,4.025) 45(-1.25,4.025) 46(-1.75,4.025) 47(-2.25,4.025) 48(-2.75,4.025)
MSOP-10
  rect 1.4x0.3 smd: 1(-2.2,1) 2(-2.2,0.5) 3(-2.2,0) 4(-2.2,-0.5) 5(-2.2,-1) 6(2.2,-1) 7(2.2,-0.5) 8(2.2,0) 9(2.2,0.5) 10(2.2,1)
Pad_e292
  round 4.5 hole 3: 1(0,0)
Pad_e293
  round 4.5 hole 3: 1(0,0)
Pad_e294
  round 4.5 hole 3: 1(0,0)
Pad_e295
  round 4.5 hole 3: 1(0,0)
R0603
  rect 0.806x0.864 smd: 1(-0.753,0) 2(0.753,0)
RESC6332[2512]S
  rect 1.8x3.2 smd: 1(-2.8,0) 2(2.8,0)
S8550P_SOT
  rect 1.25x0.701 smd: 1(1.292,-0.95) 2(1.292,0.95) 3(-1.208,0)
SMA_L4.4-W2.8-LS5.4-R-RD
  rect 2.062x1.539 smd: 1(2.503,0) 2(-2.503,0)
SOD-123_L2.7-W1.6-LS3.7-RD
  rect 0.91x1.22 smd: 1(-1.635,0) 2(1.635,0)
SOD-123_L2.8-W1.8-LS3.7-RD
  rect 0.95x1.15 smd: 1(-1.692,0) 2(1.692,0)
SOD-123F_L2.8-W1.8-LS3.7-RD
  rect 1x1.2 smd: 1(-1.55,0) 2(1.55,0)
SOT-23-3_L2.9-W1.3-P1.90-LS2.4-BR
  rect 1.25x0.7 smd: 1(1,-0.95) 2(1,0.95) 3(-1,0)
SOT-23-6
  rect 1.1x0.6 smd: 1(-1.3,0.95) 2(-1.3,0) 3(-1.3,-0.95) 4(1.3,-0.95) 5(1.3,0) 6(1.3,0.95)
SOT-363
  rect 0.8x0.4 smd: 1(-0.95,0.65) 2(-0.95,0) 3(-0.95,-0.65) 4(0.95,-0.65) 5(0.95,0) 6(0.95,0.65)
SP1N28STER
  rect 2.5x3.4 smd: 0(0,0)
  rect 1.6x0.65 smd: 1(-2.7,1.905) 2(-2.7,0.635) 3(-2.7,-0.635) 4(-2.7,-1.905) 5(2.7,-1.905) 6(2.7,-0.635) 7(2.7,0.635) 8(2.7,1.905)
SW-SMD_4P_PTS810SJM250SMTRLFS
  rect 1.2x0.65 smd: 1(-2.078,1.083) 2(2.078,1.075) 3(-2.077,-1.083) 4(2.071,-1.075)
T94/106-LAY
  round 4 hole 2.6: 1(0,0) 2(16,0)
TO-220-LAY
  round 1.7 hole 1: 1(0,0) 2(2.54,0) 3(5.08,0)
WirePad-4x6
  rrect 6x4 smd: 1(0,0)
X3225-4
  rrect 1.143x1 smd: 1(-1.169,-0.874) 2(1.169,-0.874) 3(1.169,0.874) 4(-1.169,0.874)
XH2.54-2P-DV
  rrect 1.5x1.5 hole 0.9: 1(0,0)
  round 1.5 hole 0.9: 2(2.54,0)

## Nets
As in the schematic, except:
GNDMCU: C17.2 C18.1 C19.1 C20.1 C21.1 C22.1 C23.2 C25.2 D3.2 FB1.2 FB3.2 P4.3 P4.5 P5.1 PWR1.1 R27.2 SW4.3 SW4.4 U3.23 U3.35 U3.44 U3.47 U4.2 Y1.2 Y1.4
$1N207: R9.2 R10.2 SW4.1 SW4.2

Pads without a net: NOREF 1; NOREF#2 1; NOREF#3 1; NOREF#4 1; P4 6 8; U3 2 3 4 21 22 25 26 27 28 32 33 46; U5 5; U6 5; U7 0

## Via types
v1: diameter 0.61, hole 0.305, Top Layer to Bottom Layer, 306 vias

## Routing (per net, layer and track width the routed paths; a pad name or vN(x,y) marks a point on that pad's centre or on a via; arc(x,y) is an arc through that point)
GND: length 8
  Top Layer w0.381: 67.56,30.62 67.56,31.24 U5.9 ; U2.2 80.77,51.19 80.26,50.68 77.98,50.68 ; U6.9 72.3,15.88 v1(70.36,15.88)
  vias: v1(48.14,25.98) v1(48.14,25.22) v1(48.14,24.45) v1(48.9,25.98) v1(48.9,25.22) v1(48.9,24.45) v1(49.11,13.14) v1(49.11,12.38) v1(49.88,13.14) v1(49.88,12.38) v1(50.24,26.69) v1(50.24,25.93) v1(50.64,13.14) v1(50.64,12.38) v1(50.69,11.59) v1(50.69,10.83) v1(51,26.69) v1(51,25.93) v1(51.45,11.59) v1(51.45,10.83) v1(51.76,26.69) v1(51.76,25.93) v1(52.21,11.59) v1(52.21,10.83) v1(59.6,40.39) v1(59.6,39.63) v1(60.36,40.39) v1(60.36,39.63) v1(60.93,33.63) v1(61.12,40.39) v1(61.12,39.63) v1(62.23,34.17) v1(62.23,33.08) v1(63.5,24.77) v1(63.5,24.01) v1(63.5,23.12) v1(63.5,22.36) v1(64.26,24.77) v1(64.26,24.01) v1(64.26,23.12) v1(64.26,22.36) v1(65.02,24.77) v1(65.02,24.01) v1(65.02,23.12) v1(65.02,22.36) v1(66.8,44.59) v1(68.24,44.59) v1(68.24,43.05) v1(71.88,49.16) v1(72.9,48.65) v1(73.66,53.98) v1(74.42,47.89) v1(74.93,53.73) v1(75.18,23.76) v1(75.18,23) v1(75.18,22.23) v1(75.95,52.97) v1(75.95,23.76) v1(75.95,23) v1(75.95,22.23) v1(76.45,42.55) v1(76.45,41.79) v1(76.45,12.84) v1(76.45,12.07) v1(77.22,42.55) v1(77.22,41.79) v1(77.22,12.84) v1(77.22,12.07) v1(77.98,42.55) v1(77.98,41.79) v1(77.98,12.84) v1(77.98,12.07) v1(83.13,48.05) v1(83.25,49.69) v1(83.38,51.04) v1(84.28,49.58) v1(86.1,51.44) v1(87.63,51.58) v1(88.9,51.44) v1(91.65,13.95) v1(91.65,13.19) v1(91.65,12.43) v1(91.69,7.5) v1(91.69,6.74) v1(91.95,44.84) v1(91.95,44.08) v1(92.41,13.95) v1(92.41,13.19) v1(92.41,12.43) v1(92.46,7.5) v1(92.46,6.74) v1(92.71,44.84) v1(92.71,44.08) v1(93.22,7.5) v1(93.22,6.74) v1(93.47,44.84) v1(93.47,44.08)
GNDMCU: length 63.7
  Top Layer w0.28: v1(34.04,51.7) 33.54,51.2 U3.44
  Top Layer w0.381: 69.94,45.6 FB1.2 69.94,40.27 76.94,33.27 76.94,32.42 81.03,28.33 82.3,28.33 84.01,26.61 84.01,22.87 v1(84.01,22.87) ; U3.23 42.83,54.2 C21.1 ; v1(81.74,22.01) 81.74,18.98 82.3,18.42 82.8,18.42 83.31,17.92 U4.2 ; R27.2 80.34,15.55 81.28,14.61 83.13,14.61 84.01,15.5 v1(84.01,15.88)
  Bottom Layer w0.305: PWR1.1 2.04,53.88 SW4.4 5.62,54.43 SW4.3
  Bottom Layer w0.381: v1(81.74,22.01) 83.15,22.01 v1(84.01,22.87) 84.01,15.89 v1(84.01,15.88) ; v1(34.04,54.62) 35.43,54.62 36.17,53.88 v1(36.53,53.88)
  vias: v1(26.16,43.82) v1(27.3,43.82) v1(28.4,43.82) v1(30.36,55.7) v1(35.26,44.14) v1(37.08,44.24) v1(43.97,44.61) v1(46.59,43.38) v1(46.88,44.43) v1(47.84,44.4) v1(47.84,43.03) v1(48.86,43.76) v1(65.53,51.44) v1(68.07,51.44)
VBATO: length 11.1
  Top Layer w0.381: 78.49,15.52 78.85,15.52 82.55,11.82 ; R32.2 86.66,16.64 84.88,18.42 83.82,18.42 83.31,18.93 U4.5
VCC3V3: length 190.5
  Top Layer w0.254: FB2.1 38.95,42.81 30.99,42.81 29.97,43.82 29.97,47.19 C22.2 ; R18.1 43.06,43.82 45.72,43.82 45.72,46.41 51.52,52.21 59.69,52.21 P5.3
  Top Layer w0.28: R18.1 42.19,44.5 FB2.1 ; C21.2 41.93,54.7 U3.24 ; C22.2 31.24,47.89 ; 31.24,47.89 33.79,47.89 33.83,47.93 33.83,48.86 33.53,49.16 32.59,49.16 U3.48 31.24,47.89
  Top Layer w0.305: v1(28.96,55.64) 30.1,56.78 v1(32.51,56.78) 33.27,56.02 33.79,56.02 U3.36 ; v1(10.67,51.44) 5.33,51.44 R11.1 R5.2 2.54,52.71 R9.1 ; v1(16.13,51.44) 16.49,51.8 Q2.2 18.29,53.82 18.29,54.49
  Top Layer w0.381: v1(40.38,56.78) 42.42,56.78 43.18,56.02 ; P4.1 65.18,57.39 44.58,57.39 43.38,56.18 ; U4.3 83.96,16.79 83.82,16.65 83.5,16.65 v1(82.61,15.76)
  Top Layer w0.508: P4.1 67.7,56.02 68.63,55.08 70.15,55.08 ; Q3.2 14.41,51.56 v1(14.4,51.55) ; 70.15,55.08 70.15,54.53 64.01,48.39 P5.3 ; 70.15,55.08 L2.1 ; R28.1 80.36,20.71 v1(80.34,20.71)
  Bottom Layer w0.305: v1(16.13,51.44) 16.03,51.55 v1(14.4,51.55) 10.77,51.55 v1(10.67,51.44) ; v1(18.29,54.36) 18.29,54.49 19.3,55.51 19.3,56.52 20.07,57.29 27.18,57.29 28.83,55.64 v1(28.96,55.64) ; v1(77.22,48.32) 80.16,48.32 v1(80.28,48.2)
  Bottom Layer w0.381: v1(32.51,56.78) v1(40.38,56.78)
  Bottom Layer w0.508: 82.55,15.63 82.55,18.5 v1(80.34,20.71) 80.28,20.77 v1(80.28,48.2)
VCC12V: length 89.8
  Top Layer w0.508: C40.2 68.52,16.57 v1(68.26,16.57) ; L1.2 74.19,45.58 73.29,46.48 67.95,46.48 P5.2 ; v1(64.01,36.31) 64.01,36.2 66.29,33.92 v1(66.8,33.92) ; R1.2 85.34,43.37 84.45,44.27 C4.2
  Top Layer w1.27: C3.1 89.53,42.45 P3.1
  Bottom Layer w0.508: v1(67.31,21.22) 67.31,28.94 64.77,31.48 v1(64.77,31.99) v1(65.48,31.99) 66.8,33.31 v1(66.8,33.92) 67.42,34.54 67.42,36.31 ; v1(76.71,45.6) v1(75.69,44.59) 67.42,36.31 ; v1(64.01,36.31) 67.42,36.31 ; v1(81.28,54.49) v1(81.28,46.36) ; 65.48,31.99 68.07,29.4 v1(68.07,21.22) 68.07,20.35 v1(70.15,18.28) 68.44,16.57 v1(68.26,16.57)
  vias: v1(67.59,16.57)
DBGRX: length 18.6
  Top Layer w0.28: P4.9 53.73,56.02 46.91,49.2 U3.13
DBGTX: length 23.1
  Top Layer w0.28: P4.7 57.66,54.75 53,54.75 47.07,48.82 43.18,48.82 42.11,47.75 39.5,47.75 39.33,47.93
DIG1: length 30
  Top Layer w0.28: v1(37.59,50.17) 38.18,50.17 38.54,49.81 39.53,49.81 39.64,49.7 U3.14
  Bottom Layer w0.28: v1(16.37,50.12) 16.81,49.67 16.81,47.58 19.56,44.84 32.26,44.84 v1(37.59,50.17)
DIG2: length 32.7
  Top Layer w0.305: R15.2 13.32,48.46 16.18,45.6 v1(24.38,45.6) ; U3.15 38.96,50.2 38.15,51.01 v1(37.72,51.01)
  Bottom Layer w0.305: v1(37.72,51.01) 37.51,51.01 32.61,46.11 24.89,46.11 v1(24.38,45.6)
DIGA: length 25.4
  Top Layer w0.305: U3.18 40.6,51.7 37.34,51.7 v1(36.58,50.94)
  Bottom Layer w0.305: v1(36.58,50.94) 36.42,50.94 32.36,46.87 21.72,46.87 21.72,48.78 21.03,49.46 20.28,49.46 v1(19.69,50.06)
DIGB: length 22.8
  Top Layer w0.305: U3.19 40.6,52.21 36.83,52.21 v1(35.56,50.94)
  Bottom Layer w0.305: v1(21.21,50.05) 23.24,50.05 24.38,48.9 24.38,48.4 25.4,47.38 31.85,47.38 35.41,50.94 v1(35.56,50.94)
DIGC: length 20.3
  Top Layer w0.305: v1(35.56,52.21) 36.07,52.71 38.61,52.71 38.62,52.7 U3.20
  Bottom Layer w0.305: v1(35.56,52.21) 32.6,49.25 25.05,49.25 v1(22.73,51.56)
DIGD: length 9.6
  Top Layer w0.28: v1(28.57,54.24) 31.16,54.24 31.7,53.7 U3.39
  Bottom Layer w0.305: v1(28.57,54.24) 26.93,54.24 v1(24.26,51.56)
DIGDP: length 2.3
  Top Layer w0.28: R26.1 31.43,51.56 31.57,51.7 U3.43
DIGE: length 7.8
  Top Layer w0.28: U3.40 31.45,53.2 31.04,53.6 v1(28.07,53.6)
  Bottom Layer w0.305: v1(25.78,51.56) 27.82,53.6 v1(28.07,53.6)
DIGF: length 7.6
  Top Layer w0.28: v1(28.7,52.97) 30.93,52.97 31.19,52.7 U3.41
  Top Layer w0.305: v1(27.18,50.05) 27.3,50.05 R24.1
  Bottom Layer w0.305: v1(27.18,50.05) 28.7,51.57 v1(28.7,52.97)
DIGG: length 4.2
  Top Layer w0.28: R25.1 29.73,52.46 30.73,52.46 30.99,52.2 U3.42
EN: length 60.3
  Top Layer w0.254: v1(69.09,56.02) 70.61,57.54 85.09,57.54 85.34,57.29 85.34,55.25 85.85,54.75
  Top Layer w0.28: v1(33.86,53.7) 33.79,53.7 33.29,54.2 U3.38 ; v1(42.01,53.12) 43.03,53.12 44.7,51.44 48.23,51.44 v1(49.66,52.87)
  Bottom Layer w0.254: v1(49.66,52.87) 50.32,52.21 64.52,52.21 65.28,52.97 65.28,53.98 66.04,54.75 67.82,54.75 v1(69.09,56.02)
  Bottom Layer w0.28: 41.91,53.22 36.04,53.22 35.55,53.7 v1(33.86,53.7)
FAN: length 54.6
  Top Layer w0.28: v1(52.88,51.5) 56.39,47.99 P5.6 ; v1(36.32,54.75) 36.33,54.75 U3.31
  Top Layer w0.305: 79.51,52.9 79.85,53.23 84.33,53.23 R12.1
  Bottom Layer w0.28: v1(36.32,54.75) 37.08,54.75 37.34,55 42.13,55 45.64,51.5 52.53,51.5
  Bottom Layer w0.305: P5.6 56.46,47.89 58.46,49.88 76.51,49.88 v1(79.53,52.9)
LCCA: length 20.2
  Top Layer w0.508: D2.1 56.61,27.85 R34.2 ; D2.1 56.24,29.47 55.73,29.98 55.73,33.01 57.66,34.93 ; D2.1 57.54,29.47 R37.2
  Bottom Layer w1.524: Q4.3 53.64,38.24 56.43,35.44 Q5.2
LCCB: length 21.2
  Top Layer w0.381: D7.1 57.11,13.37 R43.2
  Top Layer w0.508: Q7.2 58.42,20.96 59.69,19.7 59.69,16.51 R46.2 ; 59.69,16.51 58.81,15.63 D7.1
  Bottom Layer w1.524: Q7.2 56.39,20.96 53.85,23.5 Q6.3
  vias: v1(1.27,3.44) v1(1.27,2.68) v1(1.27,1.91) v1(1.27,1.15) v1(1.55,10.44) v1(1.55,9.68) v1(1.55,8.92) v1(1.55,8.16) v1(2.03,3.44) v1(2.03,2.68) v1(2.03,1.91) v1(2.03,1.15) v1(2.31,10.44) v1(2.31,9.68) v1(2.31,8.92) v1(2.31,8.16) v1(2.79,3.44) v1(2.79,2.68) v1(2.79,1.91) v1(2.79,1.15) v1(3.07,10.44) v1(3.07,9.68) v1(3.07,8.92) v1(3.07,8.16) v1(3.56,3.44) v1(3.56,2.68) v1(3.56,1.91) v1(3.56,1.15) v1(3.83,10.44) v1(3.83,9.68) v1(3.83,8.92) v1(3.83,8.16) v1(14.72,7.93) v1(14.72,7.17) v1(14.72,6.41) v1(14.72,5.65) v1(15.15,3.38) v1(15.15,2.62) v1(15.15,1.85) v1(15.15,1.09) v1(15.48,7.93) v1(15.48,7.17) v1(15.48,6.41) v1(15.48,5.65) v1(15.92,3.38) v1(15.92,2.62) v1(15.92,1.85) v1(15.92,1.09) v1(16.24,7.93) v1(16.24,7.17) v1(16.24,6.41) v1(16.24,5.65) v1(16.68,3.38) v1(16.68,2.62) v1(16.68,1.85) v1(16.68,1.09) v1(17,7.93) v1(17,7.17) v1(17,6.41) v1(17,5.65) v1(17.44,3.38) v1(17.44,2.62) v1(17.44,1.85) v1(17.44,1.09)
LED: length 28.4
  Top Layer w0.28: v1(18.42,50.81) 31.47,50.81 31.57,50.7 U3.45
  Bottom Layer w0.305: STA1.1 16.93,52.3 18.29,50.94
MOD: length 38.2
  Top Layer w0.305: U3.30 36.83,56.78 36.06,57.55 14.23,57.55 12.19,55.51 12.19,53.98 10.29,52.08 6.74,52.08 R10.1
PC: length 62.4
  Top Layer w0.254: 38.83,47.93 38.83,46.97 38.93,46.87 39.62,46.87 39.88,47.13 v1(41.4,47.13) ; P5.5 58.93,45.5 v1(59.13,45.3)
  Top Layer w0.381: v1(81.53,27.31) 81.03,27.31 76.45,31.89 76.45,33.07 65.3,44.22 v1(65.3,45.3)
  Top Layer w0.508: R31.1 82.56,26.3 D3.1
  Bottom Layer w0.381: v1(59.13,45.3) v1(65.3,45.3) ; v1(41.4,47.13) 42.16,47.13 43.89,45.4 59.11,45.4
PV: length 61.6
  Top Layer w0.254: v1(40.84,48.55) 39.98,48.55 39.37,49.16 38.6,49.16 38.33,48.88 38.33,47.93
  Top Layer w0.381: R29.1 80.51,23.49 R30.2 80.51,25.1 C24.2 80.46,25.33 C43.2 78.72,27.33 75.44,30.62 75.44,33.41 61.47,47.38 P5.4
  Bottom Layer w0.254: v1(40.84,48.55) 41.35,48.55 43.79,46.11 60.71,46.11 61.47,46.87 P5.4
PWMEN: length 67.9
  Top Layer w0.28: v1(42.16,51.44) 41.92,51.2 U3.17
  Top Layer w0.305: U6.7 72.3,14.87 v1(70.61,14.87) ; U5.7 69.53,30.26 71.27,30.26 v1(71.35,30.18) 71.37,30.16 R36.1
  Top Layer w0.381: R36.1 72.3,30.1 74.4,32.19 74.4,33.76 64.36,43.8 63.25,43.8 v1(60.17,46.87)
  Bottom Layer w0.28: v1(42.16,51.44) 45.72,47.89 P5.9
  Bottom Layer w0.381: v1(60.17,46.87) 59.69,46.87 59.44,46.62 50.04,46.62 P5.9
  Bottom Layer w0.508: v1(70.61,14.87) 73.41,17.66 73.41,28.13 v1(71.35,30.18)
PWMINA: length 46.7
  Top Layer w0.28: v1(46.84,50.1) 42.49,50.1 41.89,50.7 U3.16
  Top Layer w0.305: U5.8 70.48,30.74 R35.1
  Top Layer w0.381: P5.7 58.67,43.06 64.42,43.06 73.91,33.56 73.91,32.39 73.16,31.64 R35.1
  Bottom Layer w0.28: v1(46.84,50.1) 51.64,50.1 P5.7
PWMINB: length 66.7
  Top Layer w0.28: U3.29 37.33,54.5 v1(37.59,54.24)
  Top Layer w0.305: v1(74.17,15.38) U6.8
  Top Layer w0.381: v1(73.15,33.41) 64.77,41.79 57.4,41.79 P5.8
  Bottom Layer w0.28: v1(37.59,54.24) 41.74,54.24 46.92,49.06 50.65,49.06 51.31,48.4 P5.8
  Bottom Layer w0.381: v1(73.15,33.41) 74.17,32.39 v1(74.17,15.38)
RST: length 24.9
  Top Layer w0.254: 36.83,47.93 36.83,48.88 37.21,49.26 v1(37.69,49.26)
  Top Layer w0.28: P4.10 52.26,53.48 44.84,46.05 C19.2
  Top Layer w0.305: 43.69,46.05 43.63,46.1 42.04,46.1
  Bottom Layer w0.254: v1(37.69,49.26) 40.84,46.11 v1(42.14,46.11)
SWCLK: length 34.9
  Bottom Layer w0.28: v1(32.51,55) 32.96,55.44 42.61,55.44 44.45,57.29 61.72,57.29 62.99,56.02 62.99,54.49 P4.4
SWDIO: length 36.5
  Top Layer w0.28: v1(42.62,52.33) 44.12,50.83 v1(47.6,50.83) ; U3.34 34.83,53.3 v1(35.1,53.02)
  Bottom Layer w0.28: v1(35.1,53.02) 35.7,53.02 36.39,52.33 v1(42.62,52.33) ; P4.2 63.86,50.78 47.65,50.78
$1N207: length 4.5
  Top Layer w0.508: v1(5.63,56.59) 5.3,56.26 R10.2 R9.2 2.19,56.61 v1(1.46,56.61)
$1N403: length 8.5
  Top Layer w0.508: R40.2 87.63,54.48 R41.2 89.04,53.09 91.57,50.56 93.47,50.56
$1N541:
  vias: v1(4.57,50.65)
$1N1505: length 3.3
  Top Layer w0.508: U1.4 83.06,32.64 R3.2
$1N1506: length 16.2
  Top Layer w0.508: D1.2 88.37,31.89 C6.1
  Top Layer w1.27: C6.1 93.2,37.3 92.09,38.41 88.62,38.41 C7.2 87.12,36.9 C8.2
$1N1507: length 3.3
  Top Layer w0.508: 77.48,34.44 79.41,31.72
$1N1508: length 1.5
  Top Layer w0.508: R4.1 83.77,40.97 C5.2
$1N1509: length 3.7
  Top Layer w0.508: R4.2 82.8,38.49 81.79,38.49 81.79,37.25 U1.6
$1N1550: length 4.1
  Top Layer w0.508: U1.5 83.28,37.47 R2.2 85.34,37.97 R1.1
$1N1853: length 4.1
  Top Layer w0.508: Q1.1 85.28,50.76 R13.1 86.1,52.95 R12.2
$1N1871: length 3.4
  Top Layer w0.508: Q1.3 85.03,48.48 85.94,48.48 P3.2
$1N2473: length 7.1
  Top Layer w0.28: Y1.1 34.38,46.8 31.21,46.8 C17.1 ; 35.83,47.93 35.83,46.84 35.2,46.22
$1N2508: length 10.5
  Top Layer w0.28: 36.33,47.93 36.33,46.8 36.07,46.55 36.07,43.57 35.81,43.32 33.77,43.32 Y1.3 32.5,44.59 C18.2
$1N2983: length 4
  Top Layer w0.305: 37.83,47.93 37.83,46.83 38.61,46.05 40.24,46.05 40.39,46.2
$1N3027: length 4.1
  Top Layer w0.305: 37.33,47.93 37.33,46.69 37.08,46.45 FB3.1 38.38,44.65 38.61,44.65
$1N4290: length 1.6
  Top Layer w0.381: R7.2 81.81,48.29 R6.1
$1N4601:
  vias: v1(2.03,50.64)
$1N4657: length 6.6
  Top Layer w0.381: 81.79,51.7 82.3,51.7 R8.2 ; C13.1 80.16,49.87 R7.1 81.11,50.68 81.53,50.68 81.72,50.87 U2.3
$1N4721: length 2.8
  Top Layer w0.381: C14.1 78.04,52.22 78.6,51.67 U2.1
$1N5172: length 3.9
  Top Layer w0.381: R28.2 80.37,17.68 R27.1 82.48,17.65 U4.1
$1N5239: length 2.5
  Top Layer w0.381: R31.2 82.8,19.95 82.66,19.95 U4.6
$1N5693: length 1.5
  Top Layer w0.381: D5.1 78.74,19.04 R29.2
$1N6824:
  vias: v1(1.12,28.23) v1(1.12,27.46) v1(1.12,26.7) v1(1.12,25.94) v1(1.21,22.71) v1(1.21,21.95) v1(1.21,21.18) v1(1.21,20.42) v1(1.88,28.23) v1(1.88,27.46) v1(1.88,26.7) v1(1.88,25.94) v1(1.97,22.71) v1(1.97,21.95) v1(1.97,21.18) v1(1.97,20.42) v1(2.64,28.23) v1(2.64,27.46) v1(2.64,26.7) v1(2.64,25.94) v1(2.73,22.71) v1(2.73,21.95) v1(2.73,21.18) v1(2.73,20.42) v1(2.91,16.17) v1(2.91,15.41) v1(2.91,14.64) v1(2.91,13.88) v1(3.4,28.23) v1(3.4,27.46) v1(3.4,26.7) v1(3.4,25.94) v1(3.49,22.71) v1(3.49,21.95) v1(3.49,21.18) v1(3.49,20.42) v1(3.68,16.17) v1(3.68,15.41) v1(3.68,14.64) v1(3.68,13.88) v1(4.44,16.17) v1(4.44,15.41) v1(4.44,14.64) v1(4.44,13.88) v1(5.2,16.17) v1(5.2,15.41) v1(5.2,14.64) v1(5.2,13.88)
$1N7211: length 6.8
  Top Layer w0.305: U5.2 65.06,31.2 63.16,31.2 C29.2
  Top Layer w0.508: D4.1 64.01,32.38 C29.2 62.57,31.78 D9.1
$1N7329: length 1.7
  Top Layer w0.381: R49.1 69.59,29.67 U5.6
$1N7526: length 8.7
  Top Layer w0.381: R33.2 R34.1 53.87,27.21 D2.2
  Top Layer w0.508: 51.6,30.23 51.6,32.1 Q4.1
$1N7580: length 14.7
  Top Layer w0.305: U5.3 66.17,30.74 66.55,30.36 66.55,29.4 62.83,25.68 R33.1
$1N7689: length 7.3
  Top Layer w0.305: C29.1 63.87,30.24 U5.4
  Top Layer w0.508: C29.1 62.31,28.69 D9.2 60.29,29.1 R37.1
$1N7780: length 10
  Top Layer w0.381: U5.10 66.94,31.74 64.26,34.43 63.63,34.43 62.03,36.03 R38.1
$1N7784: length 27.4
  Top Layer w0.508: R38.2 60.96,36.33 v1(60.96,35.18) 59.44,35.18 58.93,35.69 58.93,36.71 Q5.1 ; D11.2 70.52,26.81 v1(65.79,26.81)
  Bottom Layer w0.508: v1(60.96,35.18) 59.94,34.16 59.94,28.58 61.72,26.81 v1(65.79,26.81)
$1N8257: length 7
  Top Layer w0.381: C34.2 65.36,17.18 D10.1 ; C34.2 66.67,15.88 U6.2 ; C34.2 66.41,16.76 D8.1
$1N8271: length 1.8
  Top Layer w0.305: 73.92,13.85 73.4,14.38 U6.6
$1N8282: length 8.1
  Top Layer w0.381: R43.1 54.05,13.34 54.05,13.69 D7.2 52.11,16.86 Q6.1
  vias: v1(54.18,13.4)
$1N8287: length 21
  Top Layer w0.381: U6.3 69.09,15.38 69.34,15.12 69.34,13.85 68.33,12.84 65.79,12.84 64.77,11.82 55.62,11.82 53.59,12.07 R42.1
$1N8296: length 6.9
  Top Layer w0.305: U6.4 65.91,14.88 C34.1 65.41,14.39 64.44,14.39 64.13,14.08 D10.2 63.08,14.08 62.15,15 R46.1
$1N8315: length 12.3
  Top Layer w0.381: R47.1 66.4,19.84 72.88,19.84 73.57,19.14 73.57,16.88 73.07,16.38 U6.10
$1N8318: length 10.2
  Top Layer w0.508: v1(61.34,19.1) 62.07,19.1 62.09,19.07 R48.1 65.61,19.07 R47.2
  Bottom Layer w0.508: Q7.1 57.66,23.5 61.34,19.81 v1(61.34,19.1)
$1N8930: length 5.5
  Top Layer w0.381: R19.2 20.19,52.07 20.19,53.92 D13.7
$1N8955: length 4.6
  Top Layer w0.381: D13.8 20.7,52.08 R20.2
$1N8979: length 2.7
  Top Layer w0.381: R21.2 21.02,48.34 D13.3
$1N9003: length 2.1
  Top Layer w0.381: R22.2 24.26,49.36 D13.2
$1N9027: length 1.7
  Top Layer w0.381: D13.1 25.78,48.34 R23.2
$1N9051: length 5
  Top Layer w0.381: R24.2 27.31,54.43 D13.10
$1N9075: length 12.3
  Top Layer w0.381: R25.2 28.83,49.79 26.42,47.38 19.12,47.38 D13.4
$1N9099: length 16.8
  Top Layer w0.381: D13.5 17.09,46.87 25.91,46.87 25.93,46.9 26.62,46.9 28.66,48.94 29.5,48.94 30.35,49.79 R26.2
$1N9205: length 5.6
  Bottom Layer w0.381: v1(18.99,52.97) 20.51,52.97 23.24,55.69 D13.9
$1N9209: length 2.4
  Top Layer w0.381: 13.72,54.68 14.34,54.68 D13.6
$1N9253: length 2.2
  Top Layer w0.508: 12.58,52 12.58,50.88 R15.1
$1N9278: length 4.5
  Top Layer w0.508: Q2.1 15.24,52.67 15.24,50.5 R14.1

## Copper pours and planes (outline as drawn; the poured copper is in the pictures)
GND on Top Layer: 54.94,45.92 87.61,45.92 87.61,-9.81 54.94,-9.81
GND on Top Layer: 45.5,14.27 58.8,14.27 58.8,9.42 45.5,9.42
GND on Top Layer: 45.27,29.26 58.82,29.26 58.82,22.76 45.27,22.76
GND on Top Layer: 109.81,-12.22 70.78,-8.67 70.7,18.5 71.03,48.33 69.45,53.93 69.5,60.89 98.18,62.65
GND on Bottom Layer: 45.52,14.28 58.51,14.28 58.51,9.39 45.52,9.39
GND on Bottom Layer: 45.21,29.6 54.51,29.6 54.51,24.01 45.21,24.01
GND on Bottom Layer: 109.55,-12.47 70.53,-8.93 70.45,18.25 70.78,48.07 69.2,53.68 69.24,60.64 97.93,62.39
GND on Bottom Layer: 54.18,46.17 86.85,46.17 86.85,-9.56 54.18,-9.56
GNDMCU on Top Layer: 25.4,45.35 29.97,45.35 29.97,42.81 25.4,42.81
GNDMCU on Top Layer: -3.61,60.46 70,60.46 70,45.61 -3.61,45.61
GNDMCU on Top Layer: 23.79,45.92 29.77,42.59 49.07,42.63 52.22,46.38
GNDMCU on Bottom Layer: -3.87,59.95 69.75,59.95 69.75,45.1 -3.87,45.1
GNDMCU on Bottom Layer: 23.79,45.92 29.77,42.59 49.07,42.63 52.22,46.38
GNDMCU on Bottom Layer: 23.79,45.92 29.77,42.59 44.34,42.62 47.44,46.3
GNDMCU on Bottom Layer: 25.4,45.35 29.97,45.35 29.97,42.81 25.4,42.81
VBAT on Top Layer: 84.16,18.99 85.69,19.93 93.09,19.93 94.75,20.95 94.72,33.84 91.33,33.84 89.81,27.95 89.82,23.59 89.02,23.11 85.78,23.13 83.77,19.77 83.82,19.34
VBATO on Top Layer: 88.96,17.52 88.96,15.73 88.94,10.87 88.82,0.33 35.33,0 32.86,3.2 32.86,33.34 37,36.89 51.05,36.88 51.82,35.95 51.31,34.68 49.78,34.17 49.28,32.39 49.02,31.38 47.1,31.24 43.19,31.2 43.1,23.8 44.81,22.22 51.05,21.97 52.07,20.96 51.05,19.95 49.28,19.69 49.28,17.15 47.07,16.39 42.79,16.36 42.79,11.12 48.58,9.91 80.44,9.91 85.86,15.72 86.91,16.64
VCC3V3 on Top Layer: 71.96,51.31 74.45,49.17 75.86,49.22 76.81,47.86 77.61,47.87 77.68,50.49 74.4,52.81 73.38,52.06
VCC12V on Top Layer: 75.02,44.41 78.42,44.36 83.27,43.85 89.31,43.89 89.78,45.64 89.86,47.31 82.42,47.01 80.67,46.98 75.38,46.55
VCC12V on Top Layer: 79.57,55.57 80.45,53.75 82.02,53.72 82.53,55.35 80.93,56.67 79.67,56.38
LCCA on Bottom Layer: 28.45,16.39 30,16.39 30.73,17.03 30.73,39.51 28.45,39.51
LCCA on Bottom Layer: 23.11,20.83 30.23,20.83 30.23,16.39 23.11,16.39
LCCA on Bottom Layer: 28.45,39.51 51.56,39.51 51.56,37.22 28.45,37.22
LCCB on Top Layer: 0.51,12.5 21.34,12.5 21.34,0.39 0.51,0.39
LCCB on Bottom Layer: 21.08,24.52 51.31,24.52 51.31,7.25 21.08,7.25
LCCB on Bottom Layer: 0.51,12.52 21.31,12.52 21.31,-1.98 0.51,-1.98
$1N1506 on Top Layer: 80.2,32.63 82.05,32.63 82.09,32.67 82.11,32.65 82.11,31.07 82.77,30.39 84.75,30.39 86.35,32.59 88.35,32.63 88.43,31.11 86.29,28.6 82.03,28.64 80.18,31.05
$1N1513 on Top Layer: 78.43,40.19 79.56,38.03 79.56,36.45 77.94,35.48 77.07,35.52 74.94,37.77 75.9,39.27
$1N4725 on Top Layer: 74.4,55.13 77.61,53.96 79.51,53.72 80.11,53.75 79.94,54.63 79.54,54.83 74.37,56.58 72.46,56.02
$1N6757 on Top Layer: 7.49,15.33 9.82,13.94 20.69,13.92 20.67,30.58 20.67,34.64 18.92,36.28 8.4,36.33 7.43,35.66
$1N6824 on Top Layer: 0,30.7 5.99,30.7 5.99,13.06 0,13.06
$1N6824 on Bottom Layer: 0,30.44 5.82,30.44 5.82,13.1 0,13.1

## Text on the board
Bottom Layer: 浙江工商大学 / 四斤苹果队 / 2023_7_1
